# EAGLE design OSO-TIBO-A1-03 (WIP) (EAGLE 9.4.2)

## Sheet 1 of 2
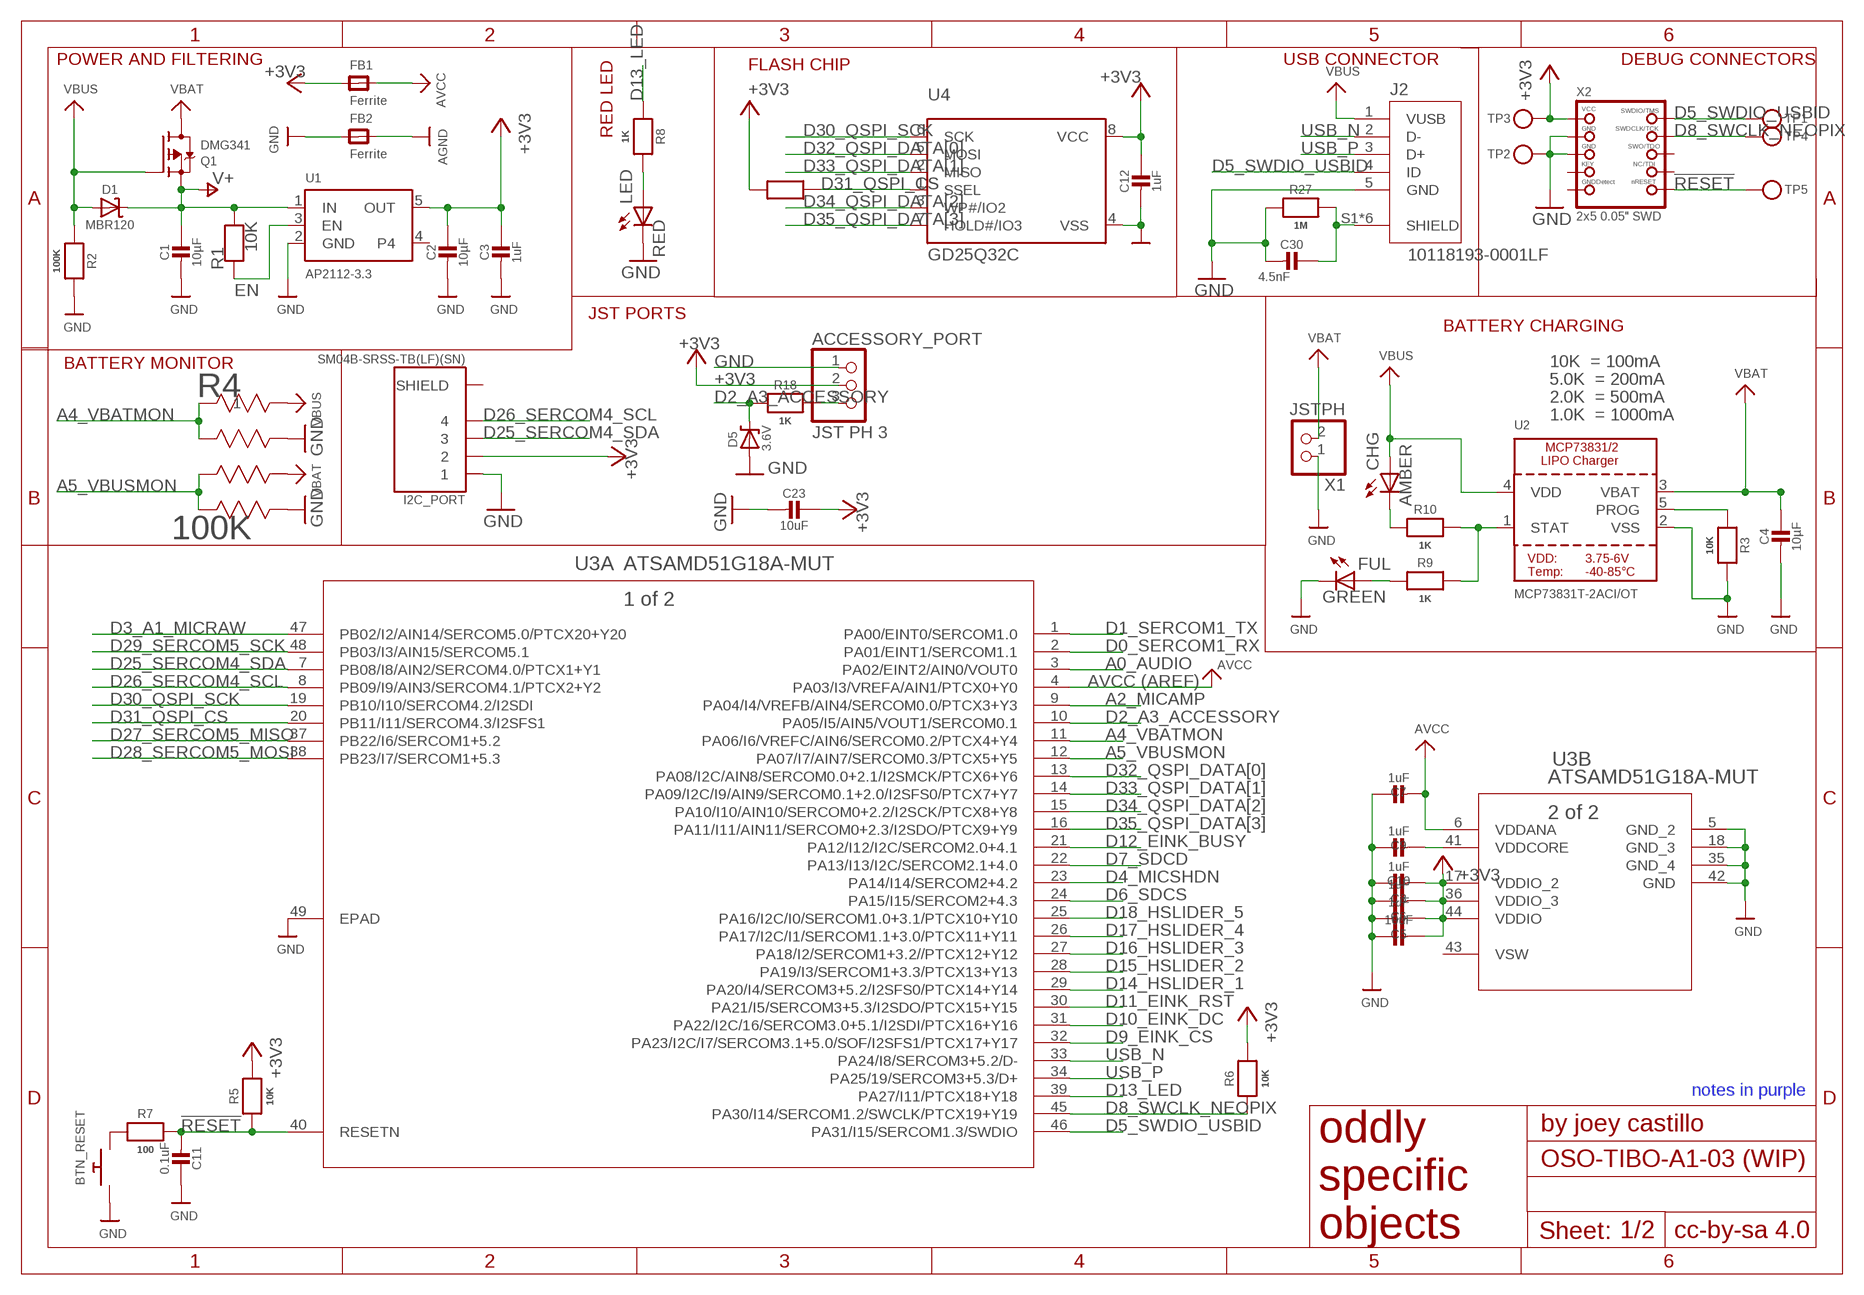
[diagram p0: schematic, sheet 1]

### Parts
ACCESSORY_PORT  JST PH 3  CON_JST_PH_3PIN  [JSTPH3]
BTN_RESET  SWITCH_PUSHBUTTONC&K_KSS  [BTN_CK_KSS]
C1  10µF  CAP_CERAMIC0805-NOOUTLINE  [0805-NO]
C2  10µF  CAP_CERAMIC0805-NOOUTLINE  [0805-NO]
C3  1uF  CAP_CERAMIC0805-NOOUTLINE  [0805-NO]
C4  10µF  CAP_CERAMIC0805-NOOUTLINE  [0805-NO]
C5  10uF  CAP_CERAMIC0805-NOOUTLINE  [0805-NO]
C6  1uF  CAP_CERAMIC0805-NOOUTLINE  [0805-NO]
C7  1uF  CAP_CERAMIC0805-NOOUTLINE  [0805-NO]
C8  1uF  CAP_CERAMIC0805_10MGAP  [0805_10MGAP]
C9  1uF  CAP_CERAMIC0805_10MGAP  [0805_10MGAP]
C10  1uF  CAP_CERAMIC0805_10MGAP  [0805_10MGAP]
C11  0.1uF  CAP_CERAMIC0805_10MGAP  [0805_10MGAP]
C12  1uF  CAP_CERAMIC0805_10MGAP  [0805_10MGAP]
C23  10uF  CAP_CERAMIC0805-NOOUTLINE  [0805-NO]
C30  4.5nF  CAP_CERAMIC0805-NOOUTLINE  [0805-NO]
CHG  AMBER  LEDCHIPLED_0805_REVERSEMOUNT  [CHIP-LED0805_REVERSEMOUNT]
D1  MBR120  DIODE-SCHOTTKYSOD-123  [SOD-123]
D5  3.6V  DIODE-ZENERSOD123  [SOD-123]
FB1  Ferrite  FERRITE0805  [0805]
FB2  Ferrite  FERRITE0805  [0805]
FUL  GREEN  LEDCHIPLED_0805_REVERSEMOUNT  [CHIP-LED0805_REVERSEMOUNT]
I2C_PORT  SM04B-SRSS-TB(LF)(SN)  [JST_SM04B-SRSS-TB(LF)(SN)]
J2  10118193-0001LF  [FCI_10118193-0001LF]
LED  RED  LEDCHIPLED_0805_REVERSEMOUNT  [CHIP-LED0805_REVERSEMOUNT]
Q1  DMG341  MOSFET-P  [SOT23-R]
R1  10K  RESISTOR0805_NOOUTLINE  [0805-NO]
R2  100K  RESISTOR0805_NOOUTLINE  [0805-NO]
R3  10K  RESISTOR0805_NOOUTLINE  [0805-NO]
R4  100K  EXB-V8V103JV  [EXBV8V]
R5  10K  RESISTOR0805_NOOUTLINE  [0805-NO]
R6  10K  RESISTOR0805_NOOUTLINE  [0805-NO]
R7  100  RESISTOR0805_10MGAP  [0805_10MGAP]
R8  1K  RESISTOR0805_NOOUTLINE  [0805-NO]
R9  1K  RESISTOR0805_NOOUTLINE  [0805-NO]
R10  1K  RESISTOR0805_NOOUTLINE  [0805-NO]
R11  10K  RESISTOR0805_NOOUTLINE  [0805-NO]
R18  1K  RESISTOR_0805MP  [_0805MP]
R27  1M  RESISTOR0805_NOOUTLINE  [0805-NO]
TP1  TESTPOINTROUND2MMNO  [TESTPOINT_ROUND_2MM_NO]
TP2  TESTPOINTROUND2MMNO  [TESTPOINT_ROUND_2MM_NO]
TP3  TESTPOINTROUND2MMNO  [TESTPOINT_ROUND_2MM_NO]
TP4  TESTPOINTROUND2MMNO  [TESTPOINT_ROUND_2MM_NO]
TP5  TESTPOINTROUND2MMNO  [TESTPOINT_ROUND_2MM_NO]
U1  AP2112-3.3  VREG_SOT23-5  [SOT23-5]
U2  MCP73831T-2ACI/OT  MCP73831/2  [SOT23-5]
U3  ATSAMD51G18A-MUT  [QFN48_7X7MC]
U4  GD25Q32C  MICROBUILDER_SPIFLASH_SOIC8  [MICROBUILDER_SOIC8_150MIL]
X1  JSTPH  CON_JST_PH_2PIN  [JSTPH2]
X2  2x5 0.05" SWD  JTAG-CORTEXBOXPOSTS  [2X05_1.27MM_BOX_POSTS]

### Nets
!RESET: C11.2 R5.1 R7.2 TP5.P$1 U3.40(A:RESETN) X2.10(NRESET)
+3V3 [power]: ACCESSORY_PORT.2 C2.1 C3.1 C5.2 C6.2 C8.2 C10.2 C12.1 C23.1 FB1.1 I2C_PORT.2 R5.2 R6.2 R11.2 TP3.P$1 U1.5(OUT) U3.17(B:VDDIO_2) U3.36(B:VDDIO_3) U3.44(B:VDDIO) U4.8(VCC) X2.1(VCC) ; also sheet 2
_ACCESSORY: ACCESSORY_PORT.3 R18.1
A0_AUDIO: U3.3(A:PA02/EINT2/AIN0/VOUT0) ; also sheet 2
A2_MICAMP: U3.9(A:PA04/I4/VREFB/AIN4/SERCOM0.0/PTCX3+Y3) ; also sheet 2
A4_VBATMON: R4.1 R4.2 U3.11(A:PA06/I6/VREFC/AIN6/SERCOM0.2/PTCX4+Y4)
A5_VBUSMON: R4.3 R4.4 U3.12(A:PA07/I7/AIN7/SERCOM0.3/PTCX5+Y5)
AGND [gnd]: FB2.2 ; also sheet 2
AVCC: C7.2 FB1.2 U3.4(A:PA03/I3/VREFA/AIN1/PTCX0+Y0) U3.6(B:VDDANA) ; also sheet 2
D0_SERCOM1_RX: U3.2(A:PA01/EINT1/SERCOM1.1) ; also sheet 2
D1_SERCOM1_TX: U3.1(A:PA00/EINT0/SERCOM1.0) ; also sheet 2
D2_A3_ACCESSORY: D5.C R18.2 U3.10(A:PA05/I5/AIN5/VOUT1/SERCOM0.1)
D3_A1_MICRAW: U3.47(A:PB02/I2/AIN14/SERCOM5.0/PTCX20+Y20) ; also sheet 2
D4_MICSHDN: U3.23(A:PA14/I14/SERCOM2+4.2) ; also sheet 2
D5_SWDIO_USBID: J2.4(ID) TP1.P$1 U3.46(A:PA31/I15/SERCOM1.3/SWDIO) X2.2(SWDIO)
D6_SDCS: U3.24(A:PA15/I15/SERCOM2+4.3) ; also sheet 2
D7_SDCD: U3.22(A:PA13/I13/I2C/SERCOM2.1+4.0) ; also sheet 2
D8_SWCLK_NEOPIX: R6.1 TP4.P$1 U3.45(A:PA30/I14/SERCOM1.2/SWCLK/PTCX19+Y19) X2.4(SWDCLK) ; also sheet 2
D9_EINK_CS: U3.32(A:PA23/I2C/I7/SERCOM3.1+5.0/SOF/I2SFS1/PTCX17+Y17) ; also sheet 2
D10_EINK_DC: U3.31(A:PA22/I2C/16/SERCOM3.0+5.1/I2SDI/PTCX16+Y16) ; also sheet 2
D11_EINK_RST: U3.30(A:PA21/I5/SERCOM3+5.3/I2SDO/PTCX15+Y15) ; also sheet 2
D12_EINK_BUSY: U3.21(A:PA12/I12/I2C/SERCOM2.0+4.1) ; also sheet 2
D13_LED: R8.1 U3.39(A:PA27/I11/PTCX18+Y18)
D14_HSLIDER_1: U3.29(A:PA20/I4/SERCOM3+5.2/I2SFS0/PTCX14+Y14) ; also sheet 2
D15_HSLIDER_2: U3.28(A:PA19/I3/SERCOM1+3.3/PTCX13+Y13) ; also sheet 2
D16_HSLIDER_3: U3.27(A:PA18/I2/SERCOM1+3.2//PTCX12+Y12) ; also sheet 2
D17_HSLIDER_4: U3.26(A:PA17/I2C/I1/SERCOM1.1+3.0/PTCX11+Y11) ; also sheet 2
D18_HSLIDER_5: U3.25(A:PA16/I2C/I0/SERCOM1.0+3.1/PTCX10+Y10) ; also sheet 2
D25_SERCOM4_SDA: I2C_PORT.3 U3.7(A:PB08/I8/AIN2/SERCOM4.0/PTCX1+Y1)
D26_SERCOM4_SCL: I2C_PORT.4 U3.8(A:PB09/I9/AIN3/SERCOM4.1/PTCX2+Y2)
D27_SERCOM5_MISO: U3.37(A:PB22/I6/SERCOM1+5.2) ; also sheet 2
D28_SERCOM5_MOSI: U3.38(A:PB23/I7/SERCOM1+5.3) ; also sheet 2
D29_SERCOM5_SCK: U3.48(A:PB03/I3/AIN15/SERCOM5.1) ; also sheet 2
D30_QSPI_SCK: U3.19(A:PB10/I10/SERCOM4.2/I2SDI) U4.6(SCK)
D31_QSPI_CS: R11.1 U3.20(A:PB11/I11/SERCOM4.3/I2SFS1) U4.1(SSEL)
D32_QSPI_DATA[0]: U3.13(A:PA08/I2C/AIN8/SERCOM0.0+2.1/I2SMCK/PTCX6+Y6) U4.5(MOSI)
D33_QSPI_DATA[1]: U3.14(A:PA09/I2C/I9/AIN9/SERCOM0.1+2.0/I2SFS0/PTCX7+Y7) U4.2(MISO)
D34_QSPI_DATA[2]: U3.15(A:PA10/I10/AIN10/SERCOM0+2.2/I2SCK/PTCX8+Y8) U4.3(WP#/IO2)
D35_QSPI_DATA[3]: U3.16(A:PA11/I11/AIN11/SERCOM0+2.3/I2SDO/PTCX9+Y9) U4.7(HOLD#/IO3)
EN: R1.1 U1.3(EN) ; also sheet 2
GND [gnd]: ACCESSORY_PORT.1 BTN_RESET.P$1 C1.2 C2.2 C3.2 C4.2 C5.1 C6.1 C7.1 C8.1 C9.1 C10.1 C11.1 C12.2 C23.2 C30.2 D5.A FB2.1 FUL.C I2C_PORT.1 J2.5(GND) LED.C R2.2 R3.2 R4.5 R4.7 R27.2 TP2.P$1 U1.2(GND) U2.2(VSS) U3.5(B:GND_2) U3.18(B:GND_3) U3.35(B:GND_4) U3.42(B:GND) U3.49(A:EPAD) U4.4(VSS) X1.1 X2.3(GND) X2.5(GND) ; also sheet 2
N$1: BTN_RESET.P$2 R7.1
N$4: CHG.C R10.1
N$7: LED.A R8.2
N$9: FUL.A R9.1
PROG: R3.1 U2.5(PROG)
SHIELD [gnd]: C30.1 J2.S1(SHIELD) J2.S2(SHIELD) J2.S3(SHIELD) J2.S4(SHIELD) J2.S5(SHIELD) J2.S6(SHIELD) R27.1
STAT: R9.2 R10.2 U2.1(STAT)
USB_N: J2.2(D-) U3.33(A:PA24/I8/SERCOM3+5.2/D-)
USB_P: J2.3(D+) U3.34(A:PA25/19/SERCOM3+5.3/D+)
V+ [power]: C1.1 D1.C Q1.2(S) R1.2 U1.1(IN)
VBAT [power]: C4.1 Q1.3(D) R4.6 U2.3(VBAT) X1.2
VBUS [power]: CHG.A D1.A J2.1(VUSB) Q1.1(G) R2.1 R4.8 U2.4(VDD)
VDDCORE: C9.2 U3.41(B:VDDCORE)
Unconnected: I2C_PORT.S1(SHIELD) I2C_PORT.S2(SHIELD) U1.4 X2.6(SWO) X2.7(KEY) X2.8(TDI) X2.9(GNDDETECT)

### Notes on the sheet
- RED LED
- POWER AND FILTERING | USB CONNECTOR | DEBUG CONNECTORS
- FLASH CHIP
- JST PORTS
- BATTERY CHARGING
- BATTERY MONITOR | 10K  = 100mA
- 5.0K  = 200mA
- 2.0K  = 500mA
- 1.0K  = 1000mA
- (AREF)
- notes in purple

## Sheet 2 of 2
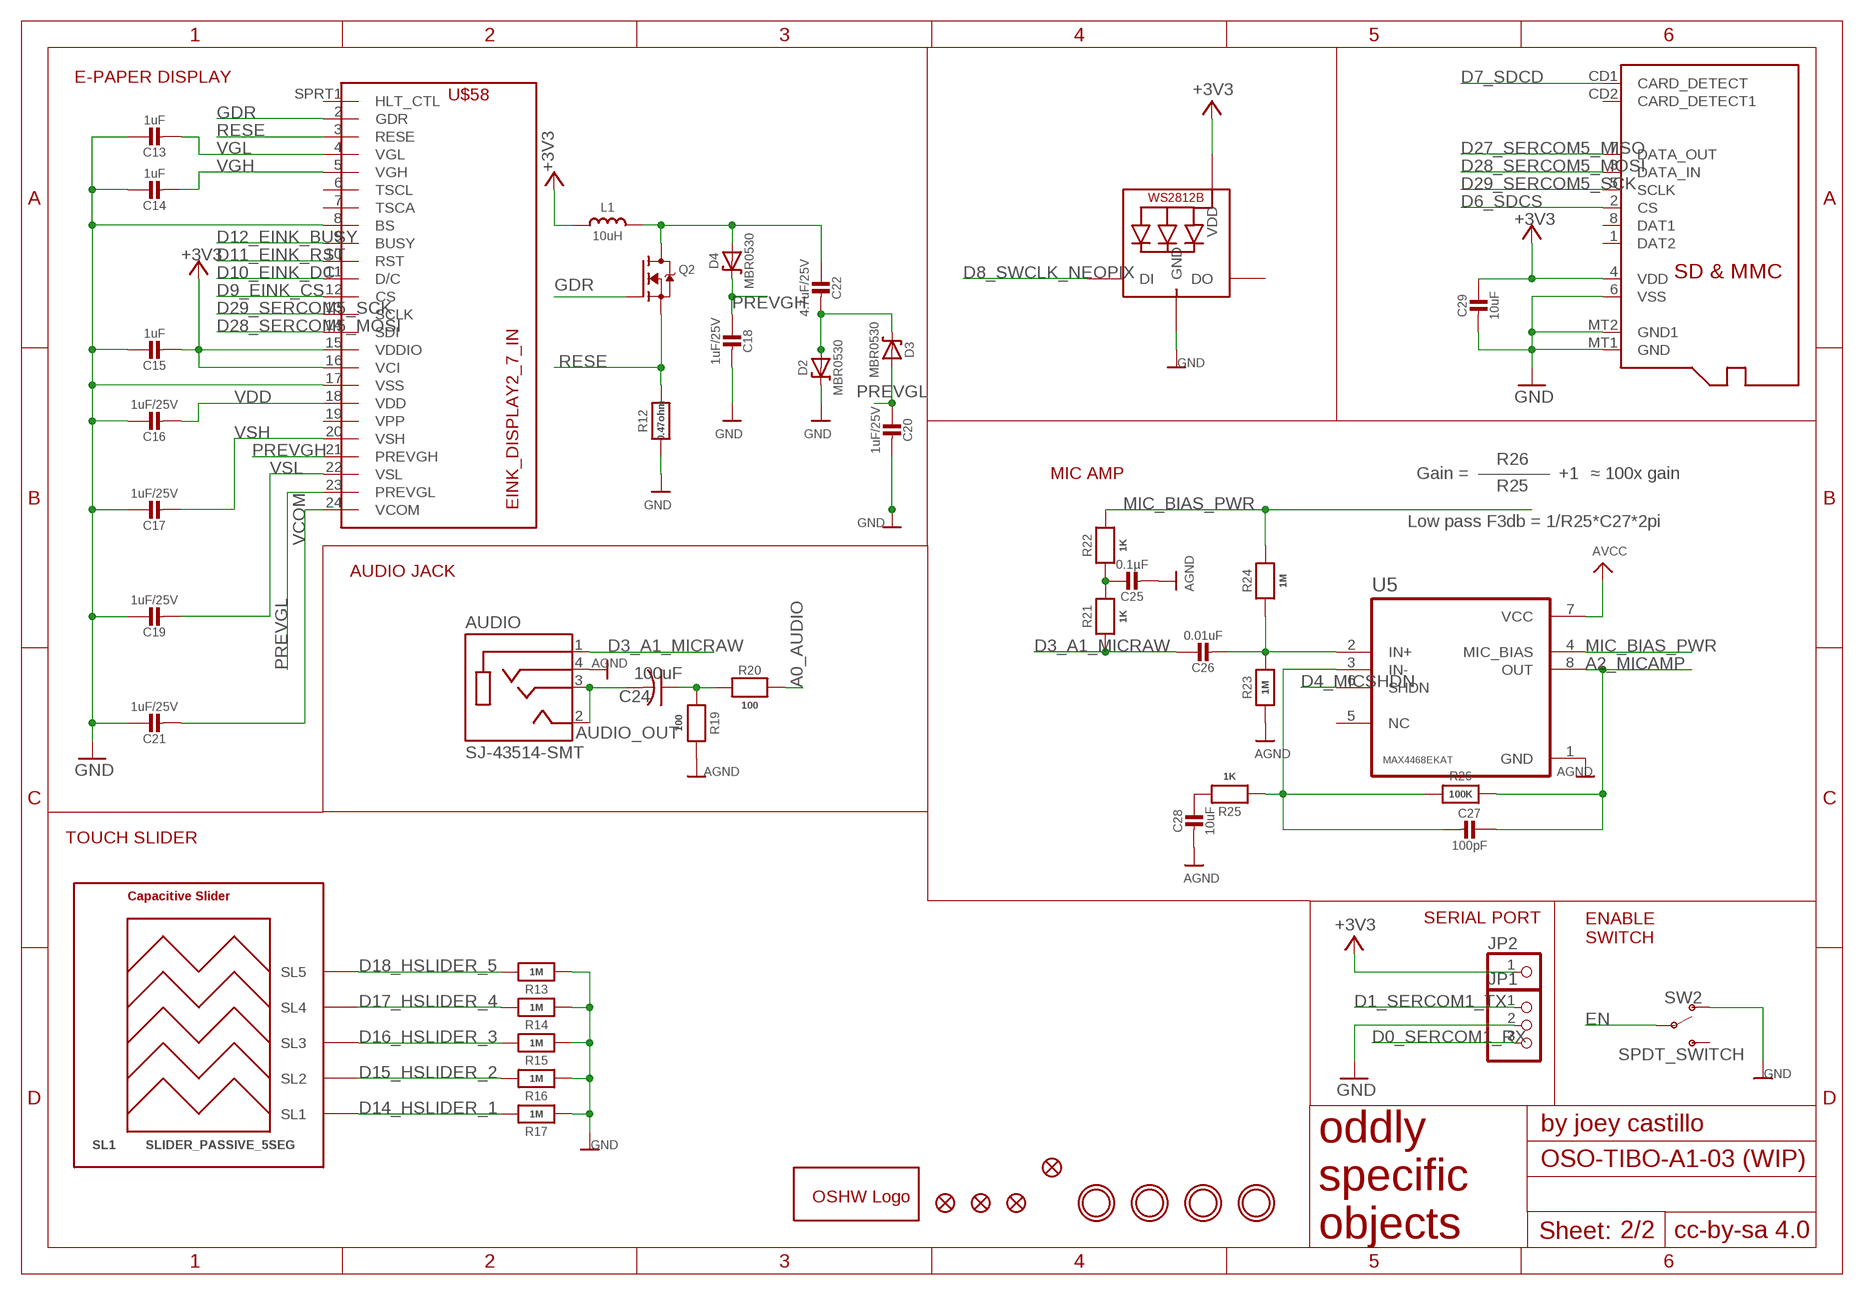
[diagram p1: schematic, sheet 2]

### Parts
AUDIO  SJ-43514-SMT  [CUI_SJ-43514-SMT]
C13  1uF  CAP_CERAMIC0805_10MGAP  [0805_10MGAP]
C14  1uF  CAP_CERAMIC0805_10MGAP  [0805_10MGAP]
C15  1uF  CAP_CERAMIC0805_10MGAP  [0805_10MGAP]
C16  1uF/25V  CAP_CERAMIC0805_10MGAP  [0805_10MGAP]
C17  1uF/25V  CAP_CERAMIC0805_10MGAP  [0805_10MGAP]
C18  1uF/25V  CAP_CERAMIC0805_10MGAP  [0805_10MGAP]
C19  1uF/25V  CAP_CERAMIC0805_10MGAP  [0805_10MGAP]
C20  1uF/25V  CAP_CERAMIC0805_10MGAP  [0805_10MGAP]
C21  1uF/25V  CAP_CERAMIC0805_10MGAP  [0805_10MGAP]
C22  4.7uF/25V  CAP_CERAMIC0805-NOOUTLINE  [0805-NO]
C24  100uF  C-USC1210  [C1210]
C25  0.1µF  CAP_CERAMIC0805-NOOUTLINE  [0805-NO]
C26  0.01uF  CAP_CERAMIC0805-NOOUTLINE  [0805-NO]
C27  100pF  CAP_CERAMIC0805-NOOUTLINE  [0805-NO]
C28  10uF  CAP_CERAMIC0805-NOOUTLINE  [0805-NO]
C29  10uF  CAP_CERAMIC0805_10MGAP  [0805_10MGAP]
D2  MBR0530  DIODE-SCHOTTKYSOD-123  [SOD-123]
D3  MBR0530  DIODE-SCHOTTKYSOD-123  [SOD-123]
D4  MBR0530  DIODE-SCHOTTKYSOD-123  [SOD-123]
D8_NEOPIXEL  WS2812B_4020  [WS2812B_4020]
FID1  FIDUCIAL_1MM  [FIDUCIAL_1MM]
FID2  FIDUCIAL_1MM  [FIDUCIAL_1MM]
FID3  FIDUCIAL_1MM  [FIDUCIAL_1MM]
FID4  FIDUCIAL_1MM  [FIDUCIAL_1MM]
GOLD_ORB_SM1  OSHWLOGOLOGO5MM  [OSHW_5MM]
JP1  PINHD-1X3  [1X03]
JP2  PINHD-1X1  [1X01]
L1  10uH  INDUCTORNR401  [INDUCTOR_4X4MM_NR401]
MICROSD  MICROSD  [MICROSD]
Q2  IRLML0100  IRLML2060TRPBF  [SOT23-3]
R12  0.47ohm  RESISTOR0805_10MGAP  [0805_10MGAP]
R13  1M  RESISTOR0805_NOOUTLINE  [0805-NO]
R14  1M  RESISTOR0805_NOOUTLINE  [0805-NO]
R15  1M  RESISTOR0805_NOOUTLINE  [0805-NO]
R16  1M  RESISTOR0805_NOOUTLINE  [0805-NO]
R17  1M  RESISTOR0805_NOOUTLINE  [0805-NO]
R19  100  RESISTOR0805_NOOUTLINE  [0805-NO]
R20  100  RESISTOR0805_NOOUTLINE  [0805-NO]
R21  1K  RESISTOR0805_NOOUTLINE  [0805-NO]
R22  1K  RESISTOR0805_NOOUTLINE  [0805-NO]
R23  1M  RESISTOR0805_NOOUTLINE  [0805-NO]
R24  1M  RESISTOR0805_NOOUTLINE  [0805-NO]
R25  1K  RESISTOR0805_NOOUTLINE  [0805-NO]
R26  100K  RESISTOR0805_NOOUTLINE  [0805-NO]
SL1  SLIDER_PASSIVE_5SEG  [SLIDER_PASSIVE_5SEG_12MM]
SW2  SPDT_SWITCH  [A10767]
U5  MAX4468EKAT  [SOT65P280X145-8N]
U$1  MOUNTINGHOLE2.5  [MOUNTINGHOLE_2.5_PLATED]
U$4  MOUNTINGHOLE2.5  [MOUNTINGHOLE_2.5_PLATED]
U$5  MOUNTINGHOLE2.5  [MOUNTINGHOLE_2.5_PLATED]
U$7  MOUNTINGHOLE2.5  [MOUNTINGHOLE_2.5_PLATED]
U$58  EINK_DISPLAY2_7_IN  [EINK_DISPLAY_2_7_IN]

### Nets
+3V3 [power]: C15.2 C29.1 D8_NEOPIXEL.2(VDD) JP2.1 L1.P$2 MICROSD.4(VDD) U$58.15(VDDIO) U$58.16(VCI) ; also sheet 1
A0_AUDIO: R20.1 ; also sheet 1
A2_MICAMP: C27.1 R26.2 U5.8(OUT) ; also sheet 1
AGND [gnd]: AUDIO.4(RING2) C25.2 C28.2 R19.1 R23.1 U5.1(GND) ; also sheet 1
AUDIO_OUT: AUDIO.2(TIP) AUDIO.3(RING1) C24.2
AVCC: U5.7(VCC) ; also sheet 1
D0_SERCOM1_RX: JP1.3 ; also sheet 1
D1_SERCOM1_TX: JP1.1 ; also sheet 1
D3_A1_MICRAW: AUDIO.1(SLEEVE) C26.1 R21.1 ; also sheet 1
D4_MICSHDN: U5.6(SHDN) ; also sheet 1
D6_SDCS: MICROSD.2(CS) ; also sheet 1
D7_SDCD: MICROSD.CD1(CARD_DETECT) ; also sheet 1
D8_SWCLK_NEOPIX: D8_NEOPIXEL.1(DI) ; also sheet 1
D9_EINK_CS: U$58.12(CS) ; also sheet 1
D10_EINK_DC: U$58.11(D/C) ; also sheet 1
D11_EINK_RST: U$58.10(RST) ; also sheet 1
D12_EINK_BUSY: U$58.9(BUSY) ; also sheet 1
D14_HSLIDER_1: R17.2 SL1.SL1 ; also sheet 1
D15_HSLIDER_2: R16.2 SL1.SL2 ; also sheet 1
D16_HSLIDER_3: R15.2 SL1.SL3 ; also sheet 1
D17_HSLIDER_4: R14.2 SL1.SL4 ; also sheet 1
D18_HSLIDER_5: R13.2 SL1.SL5 ; also sheet 1
D27_SERCOM5_MISO: MICROSD.7(DATA_OUT) ; also sheet 1
D28_SERCOM5_MOSI: MICROSD.3(DATA_IN) U$58.14(SDI) ; also sheet 1
D29_SERCOM5_SCK: MICROSD.5(SCLK) U$58.13(SCLK) ; also sheet 1
EN: SW2.P$2(P) ; also sheet 1
GDR: Q2.1(G) U$58.2(GDR)
GND [gnd]: C13.1 C14.1 C15.1 C16.1 C17.1 C18.2 C19.1 C20.2 C21.1 C29.2 D2.C D8_NEOPIXEL.4(GND) JP1.2 MICROSD.6(VSS) MICROSD.MT1(GND) MICROSD.MT2(GND1) R12.2 R13.1 R14.1 R15.1 R16.1 R17.1 SW2.P$1(O) U$58.8(BS) U$58.17(VSS) ; also sheet 1
MIC_BIAS_PWR: R22.2 R24.2 U5.4(MIC_BIAS)
N$2: C22.2 D2.A D3.C
N$3: C22.1 D4.A L1.P$1 Q2.3(D)
N$6: C24.1 R19.2 R20.2
N$65: C25.1 R21.2 R22.1
N$67: C26.2 R23.2 R24.1 U5.2(IN+)
N$68: C27.2 R25.1 R26.1 U5.3(IN-)
N$69: C28.1 R25.2
PREVGH: C18.1 D4.C U$58.21(PREVGH)
PREVGL: C20.1 D3.A U$58.23(PREVGL)
RESE: Q2.2(S) R12.1 U$58.3(RESE)
VCOM: C21.2 U$58.24(VCOM)
VDD: C16.2 U$58.18(VDD)
VGH: C14.2 U$58.5(VGH)
VGL: C13.2 U$58.4(VGL)
VSH: C17.2 U$58.20(VSH)
VSL: C19.2 U$58.22(VSL)
Unconnected: D8_NEOPIXEL.3(DO) MICROSD.1(DAT2) MICROSD.8(DAT1) MICROSD.CD2(CARD_DETECT1) SW2.P$3(S) U5.5(NC) U$58.6(TSCL) U$58.7(TSCA) U$58.19(VPP) U$58.SPRT1(HLT_CTL)

### Notes on the sheet
- E-PAPER DISPLAY
- R26
- MIC AMP | Gain = | +1 | ≈ 100x gain
- R25
- Low pass F3db = 1/R25*C27*2pi
- AUDIO JACK
- TOUCH SLIDER
- SERIAL PORT
- ENABLE
  SWITCH

## Power pins joined to a net without a drawn wire
VSW: U3.43(B:VSW)

## Library data of the parts
ACCESSORY_PORT = microbuilder:CON_JST_PH_3PIN
AUDIO = SJ-43514-SMT:SJ-43514-SMT: 4 conductor 3.5 mm Surface Mount Audio Jack; CUI_PURCHASE_URL: https://www.cui.com/product/interconnect/connectors/audio-connectors/jacks/sj-4351x-smt-series?utm_source=snapeda.com&utm_medium=referral&utm_campaign=snapedaBOM; DESCRIPTION: 3.5 mm, 4 Conductors, Right Angle, Surface Mount _SMT_, Audio Jack Connector; DIGI-KEY_PART_NUMBER: CP-43514SJCT-ND; DIGI-KEY_PURCHASE_URL: https://www.digikey.com/product-detail/en/cui-inc/SJ-43514-SMT-TR/CP-43514SJCT-ND/669734?utm_source=snapeda&utm_medium=aggregator&utm_campaign=symbol; MF: CUI Inc.; MP: SJ-43514-SMT-TR; PACKAGE: None
BTN_RESET = adafruit:SWITCH_PUSHBUTTON: Buttons SOFTTOUCHSMD_SJ - Soft touch temporary push button (Super Junk Akihabara) Compatible with SKPMANE010 [Mouser: 688-SKPMAN] C&K_KSS = Digikey: KSS221GLFS
C1-C23 C25-C30 = microbuilder:CAP_CERAMIC: Ceramic Capacitors For new designs, use the packages preceded by an '_' character since they are more reliable: The following footprints should be used on most boards: _0402 - Standard footprint for regular board layouts _0603 - Standard footprint for regular board layouts _0805 - Standard footprint for regular board layouts _1206 - Standard footprint for regular board layouts For extremely tight-pitch boards where space is at a premium, the following 'micro-pitch' footprints can be used (smaller pads, no silkscreen outline, etc.): _0402MP - Micro-pitch footprint for very dense/compact boards _0603MP - Micro-pitch footprint for very dense/compact boards _0805MP - Micro-pitch footprint for very dense/compact boards _1206MP - Micro-pitch footprint for very dense/compact boards
C24 = resistor:C-US: CAPACITOR, American symbol
CHG FUL LED = adafruit:LED: LED OSRAM: - CHIPLED LG R971, LG N971, LY N971, LG Q971, LY Q971, LO R971, LY R971 LH N974, LH R974 LS Q976, LO Q976, LY Q976 LO Q996 - Hyper CHIPLED LW Q18S LB Q993, LB Q99A, LB R99A - SideLED LS A670, LO A670, LY A670, LG A670, LP A670 LB A673, LV A673, LT A673, LW A673 LH A674 LY A675 LS A676, LA A676, LO A676, LY A676, LW A676 LS A679, LY A679, LG A679 - Hyper Micro SIDELED® LS Y876, LA Y876, LO Y876, LY Y876 LT Y87S - SmartLED LW L88C, LW L88S LB L89C, LB L89S, LG L890 LS L89K, LO L89K, LY L89K LS L896, LA L896, LO L896, LY L896 - TOPLED LS T670, LO T670, LY T670, LG T670, LP T670 LSG T670, LSP T670, LSY T670, LOP T670, LYG T670 LG T671, LOG T671, LSG T671 LB T673, LV T673, LT T673, LW T673 LH T674 LS T676, LA T676, LO T676, LY T676, LB T676, LH T676, LSB T676, LW T676 LB T67C, LV T67C, LT T67C, LS T67K, LO T67K, LY T67K, LW E67C LS E67B, LA E67B, LO E67B, LY E67B, LB E67C, LV E67C, LT E67C LW T67C LS T679, LY T679, LG T679 LS T770, LO T770, LY T770, LG T770, LP T770 LB T773, LV T773, LT T773, LW T773 LH T774 LS E675, LA E675, LY E675, LS T675 LS T776, LA T776, LO T776, LY T776, LB T776 LHGB T686 LT T68C, LB T68C - Hyper Mini TOPLED® LB M676 - Mini TOPLED Santana® LG M470 LS M47K, LO M47K, LY M47K Source: http://www.osram.convergy.de/
D1-D4 = microbuilder:DIODE-SCHOTTKY
D5 = microbuilder:DIODE-ZENER: Zener Diode SMA: 30V 1W Zener Diode, 1.2Vf - Digikey: SMAZ30-FDICT-ND
D8_NEOPIXEL = microbuilder:WS2812B
FB1 FB2 = microbuilder:FERRITE: Ferrite Bead 0603 MMZ1608B121C - 120 Ohm @ 100MHz, 600mA, 0.15 Ohm DC Resistance - Digikey: 445-2164-1-ND BK1608HW121-T - 120 Ohm, 600mA Ferrite Chip - Digikey: 587-1876-2-ND 0805 HZ0805B272R-10 - 2.7K Ohm @ 100MHz, 200mA, 0.8 Ohm DC Resistance - Digikey: 240-2504-1-ND (see also Murata BLM21BD272SN1L) MMZ2012Y152B - 1.5K Ohm @ 100MHz, 500mA, 0.4 Ohm DC Resistance - Digikey: 445-1560-1-ND - Mainly for high frequency (80-400MHz) MMZ2012R102A - 1K Ohm @ 100MHz, 500mA, 0.3 Ohm DC Resistance - Digikey: 445-1555-2-ND - More general purpose (10-200MHz)
FID1-FID4 = microbuilder:FIDUCIAL: Fiducial Alignment Points Various fiducial points for machine vision alignment.; BOM: EXCLUDE
GOLD_ORB_SM1 = oshw:OSHWLOGO: The OSHW logo for PCB layout
I2C_PORT = SM04B-SRSS-TB_LF__SN_:SM04B-SRSS-TB(LF)(SN): SH Series 1.0 mm Pitch 2 Position Single Row Side Entry Shrouded Header; DESCRIPTION: SH Series 1.0 mm Pitch 2 Position Single Row Side Entry Shrouded Header; DIGI-KEY_PART_NUMBER: 455-1804-1-ND; DIGI-KEY_PURCHASE_URL: https://www.digikey.com/product-detail/en/jst-sales-america-inc/SM04B-SRSS-TB_LF__SN_/455-1804-1-ND/926875?utm_source=snapeda&utm_medium=aggregator&utm_campaign=symbol; MF: JST Sales; MP: SM04B-SRSS-TB_LF__SN_; PACKAGE: None
J2 = 10118193-0001LF:10118193-0001LF: Micro USB B Type Receptacle; DESCRIPTION: Single Port 5 Contact Shielded SMT MICRO USB B-Type Receptacle; DIGI-KEY_PART_NUMBER: 609-4616-1-ND; DIGI-KEY_PURCHASE_URL: https://www.digikey.com/product-detail/en/amphenol-icc-fci/10118193-0001LF/609-4616-1-ND/2785380?utm_source=snapeda&utm_medium=aggregator&utm_campaign=symbol; MF: Amphenol ICC; MP: 10118193-0001LF; PACKAGE: None
JP1 = adafruit:PINHD-1X3: PIN HEADER
JP2 = adafruit:PINHD-1X1: Pin header 1x1 for 0.1" spacing With round pins
L1 = microbuilder:INDUCTOR: Inductors 0603: 10nH Ceramic Inductor - microwire antenna/RF (Digikey: 712-1434-2-ND) 0805: 560nH Ceramic Inductor - RF (Digikey: 553-1047-1-ND) 270nH Ceramic Inductor - Q = 40@250MHz, +-5%, 1 Ohm DC Resistance (Digikey: 535-10506-2-ND) 1007 (2518 Metric) SMT: 10µH 10% 250mOhm 820mA 1007 Inductor (Digikey: 587-2189-1-ND) 22µH 10% 500mOhm 580mA 1007 Inductor (Digikey: 587-2190-1-ND) 47µH 10% 950mOhm 420mA 1007 Inductor (Digikey: 587-2191-1-ND) 47µH 5% 100mOhm 1A 1008 Inductor (Digikey: 732-1816-1-ND) 5.0x5.0mm (Taiyo Yuden NR5040 Series) 6.8µH 20% 2.3A 64mOhm Inductor (Digikey: 587-2374-2-ND) 5.0x5.0mm (TDK VLC5045 Series) 4.7µH 20% 3.3A 34mOhm Inductor (Digikey: 445-6526-1-ND) 6.8µH 20% 2.7A 46mOhm Inductor (Digikey: 445-6527-1-ND) 6.0x6.0mm (TDK VLC6045 Series) 4.7µH 20% 3.8A 27mOhm Inductor (Digikey: 445-6538-2-ND) 6.8µH 20% 3A 41mOhm Inductor (Digikey: 445-6540-1-ND) 6.2µH 30% 2.2A 45mOhm Inductor (Digikey: SRR5028-6R2YCT-ND) - Not TDK VLC6045 but footprint should match 6.0x6.0mm (TDK SLF6045 Series) 6.8uH 30% 2A 33mOhm Inductor (Digikey: 445-4572-1-ND, Mouser: 810-SLF645T6R8N2R0PF) 6.0x6.0mm (Sumida CDRH5D28 Series) 6.2uH 30% 1.8A 45mOhm Inductor (Digikey: 308-1542-1-ND) Taiyo Yuden NR3015T2R2M - 2.2uH 20% 1.5A (Digikey: 587-1648-2-ND, Mouser: 963-NR3015T2R2M) - Used with TI TPS62172 CoilCraft RFID Transponder Coil - MA5532-AE (For use with AS3935 Lightning Sensor) Taiyo Yuden NRH2412T2R2MNGH - 2.2uH 20% 1AA (Digikey: 587-3443-1-ND) - Used with TI LM3671 Vishay IHLP 1.0uH Molded Inductor - 24mOhm DCR, 5A, +/-20%, -55°C-125°C (Digikey: 541-1319-1-ND)
MICROSD = adafruit:MICROSD: Micro-SD / Transflash card holder with SPI pinout For the 3M # 2908-05WB-MG and/or 4UCON #19656 push-push type
Q1 = microbuilder:MOSFET-P: P-Channel Mosfet LEGEND VDS: Voltage Drain-Source ID: Drain Current RDS(ON): Drain-Source On-State Resistance VGS(TH): Gate-Source Threshold Voltage CISS: Drain-Source Input Capacitance SOT-23 Name VDS ID RDS(ON) VGS(TH) CISS Order Number IRLML5103 30V 760mA 600 mOhm -- 75pF @ 25V Digikey: IRLML5103PBFCT-ND IRLML6401 12V 4.3A 50 mOhm 950mV @ 250µA 830pF @ 10V Digikey: IRLML6401PBFTR-ND NTR0202PL 20V 400mA 800 mOhm 2.3V @ 250uA 70pF @ 5V Digikey: NTR0202PLT1GOSTR-ND NTR4101PT1G 20V 1.8A 85 mOhm 1.2V @ 250uA 675pF @ 10V Digikey: NTR4101PT1GOSCT-ND DMP2004K 20V 600mA 900 mOhm 1V @ 250uA 175pF @ 16V Digikey: DMP2004KDICT-ND PMV65XP 20V 3.9A 76 mOhm 950mV @ 1mA 725pF @ 20V Digikey: 568-2358-2-ND TO-252 Name VDS ID RDS(ON) VGS(TH) CISS Order Number AOD417 30V 25A 34 mOhm 3V @ 250µA 920pF @ 15V Digikey: 785-1106-2-ND PowerPak Name VDS ID RDS(ON) VGS(TH) CISS Order Number AON7401 30V 12A 14 mOhm 3V @ 250µA 2600pF @ 15V Digikey: 785-1302-1-ND
Q2 = Parts:IRLML2060TRPBF
R1-R3 R5-R27 = microbuilder:RESISTOR: Resistors For new designs, use the packages preceded by an '_' character since they are more reliable: The following footprints should be used on most boards: _0402 - Standard footprint for regular board layouts _0603 - Standard footprint for regular board layouts _0805 - Standard footprint for regular board layouts _1206 - Standard footprint for regular board layouts For extremely tight-pitch boards where space is at a premium, the following 'micro-pitch' footprints can be used (smaller pads, no silkscreen outline, etc.): _0402MP - Micro-pitch footprint for very dense/compact boards _0603MP - Micro-pitch footprint for very dense/compact boards _0805MP - Micro-pitch footprint for very dense/compact boards _1206MP - Micro-pitch footprint for very dense/compact boards
R4 = resistor array:EXB-V8V103JV; MANUFACTURER_PART_NUMBER: EXBV8V103JV; VENDOR: Panasonic
SL1 = PatternAgents-TouchWidgets:SLIDER_PASSIVE_5SEG: Slider, Passive Touch/Capacitive Sensing Type, Five (5) Segment Source : http://www.PatternAgents.com Github : https://github.com/PatternAgents License : http://creativecommons.org/licenses/by-sa/3.1/ (Creative Commons 3.1) THIS SOFTWARE IS PROVIDED BY THE CONTRIBUTORS "AS IS" AND WITHOUT ANY EXPRESS OR IMPLIED WARRANTIES, INCLUDING, BUT NOT LIMITED TO, THE IMPLIED WARRANTIES OF MERCHANTABILITY AND FITNESS FOR A PARTICULAR PURPOSE ARE DISCLAIMED. IN NO EVENT SHALL THE COPYRIGHT OWNER OR CONTRIBUTORS BE LIABLE FOR ANY DIRECT, INDIRECT, INCIDENTAL, SPECIAL, EXEMPLARY, OR CONSEQUENTIAL DAMAGES (INCLUDING, BUT NOT LIMITED TO, PROCUREMENT OF SUBSTITUTE GOODS OR SERVICES; LOSS OF USE, DATA, OR PROFITS; OR BUSINESS INTERRUPTION) HOWEVER CAUSED AND ON ANY THEORY OF LIABILITY, WHETHER IN CONTRACT, STRICT LIABILITY, OR TORT (INCLUDING NEGLIGENCE OR OTHERWISE) ARISING IN ANY WAY OUT OF THE USE OF THIS SOFTWARE, EVEN IF ADVISED OF THE POSSIBILITY OF SUCH DAMAGE.
SW2 = My Stuff:SPDT_SWITCH
TP1-TP5 = microbuilder:TESTPOINT: Test Point Various test points for characterisation and PCB testing TESTPOINT_SMT - Compact Surface Mount Test Point [Digikey: 5016KTR-ND]
U1 = microbuilder:VREG_SOT23-5: SOT23-5 Fixed Voltage Regulators Part Current Out V Out V In V Dropout θJA (°C/W) TJ (°C) Digikey Part No. ADP121 150mA 3.3V 3.4-5.5V 0.09V @ 150mA -- -- ADP121-AUJZ33R7CT-ND ADP121 150mA 3.0V 3.1-5.5V 0.09V @ 150mA -- -- ADP121-AUJZ30R7CT-ND ADP122 300mA 3.3V 3.4-5.5V 0.085V @ 300mA -- -- ADP122AUJZ-3.3-R7CT-ND ADP1712 300mA 3.3V 3.5-5.5V 0.17V @ 300mA -- -- ADP1712AUJZ-3.3-R7TR-ND AP7311 (Low Cost) 150mA 3.3V 3.5-6V 0.15V @ 150mA -- -- AP7311-33WG-7DICT-ND LD39015M18R 150mA 1.8V 1.9V-5.5V 0.08V @ 100mA -- -- 497-6977-1-ND LP2985A-33DBVR 150mA 3.3V 3.3-16V 0.28V @ 150mA 206 150 296-18479-1-ND MCP1824T-3302E/OT 300mA 3.3V 3.5V-6V 0.2V @ 300mA -- -- MCP1824T-3302E/OTCT-ND MIC5205-2.5YM5 TR 150mA 2.5V 2.7-16V 0.165V @ 150mA -- -- 576-1257-2-ND MIC5205-3.0YM5 TR 150mA 3.0V 3.2V-16V 0.165V @ 150mA -- -- 576-1258-2-ND MIC5205-3.3YM5 TR 150mA 3.3V 3.5V-16V 0.165V @ 150mA -- -- 576-1259-2-ND TPS780330220 150mA 3.3V+2.2V 3.6-5.5V 250mV Max -- -- 296-23332-1-ND TDA3663/N1,135 100mA 3.3V 3.5-45V 0.18V @ 50mA -- -- 568-5343-1-ND Max operating temp can be calculated using θJA, TJ (max junction temperature), and power in watts. Set the "Maximum Ambient Temperature" until it reaches TJ ("Max Junction Temperature"), which is the absolute limit for safe use of the regulator: Heat Sink Temperature Calculator <http://www.daycounter.com/Calculators/Heat-Sink-Temperature-Calculator.phtml> For example, With 12V source into a 3.3V LP2985 and a 30mA load, we are dissipating (12V-3.3V) * 0.03A = 0.261W. With a θJA of 206 °C/W, a TJ of 150°C, and 261mW we can safely use the chip without a heat sink up to 75°C (=147.1°C Junction Temperature).
U2 = microbuilder:MCP73831/2: MCP73831/2 LIPO Charger VDD: 3.75 - 6V Temp -40 - 85°C Programmable Charge Rate: 15-500mA NOTE: STAT is a tri-state logic output on the MCP73831 and an open-drain output on the MCP73832. SOT23-5 with 4.2V output and tri-state logic on STAT = MCP73831T-2ACI/OT
U3 = ATSAMD51G18AMUT:ATSAMD51G18A-MUT; BUILT_BY: EMA_Molly; COPYRIGHT: Copyright (C) 2018 Accelerated Designs. All rights reserved; MANUFACTURER_PART_NUMBER: ATSAMD51G18A-MUT; VENDOR: Microchip
U4 = Adafruit Feather M0 Express:MICROBUILDER_SPIFLASH_SOIC8: SOIC8 SPI Flash Be careful with the size since SOIC8 flash comes in several 'widths' SOIC8 150 mil M25P16 - 16Mbit (2Mbit x 8) Serial Flash (75MHz SPI Bus), Supply: 2.7-3.6V Digikey: SOIC8 - M25P16-VMN6P-ND SOIC8 208 mil W25Q16BVSSIG - 16Mbit (2Mbit x 8) Serial Flash (104MHz SPI Bus), Supply: 2.7-3.6V Digikey: SOIC8 - W25Q16BVSSIG-ND
U5 = MAX4468EKAT:MAX4468EKAT; DESCRIPTION: Audio Amp Microphone 1-CH Mono Class-AB 8-Pin SOT-23 T/R; DIGI-KEY_PART_NUMBER: MAX4468EKA+CT-ND; DIGI-KEY_PURCHASE_URL: https://www.digikey.com/product-detail/en/maxim-integrated/MAX4468EKA-T/MAX4468EKA-CT-ND/5405777?utm_source=snapeda&utm_medium=aggregator&utm_campaign=symbol; MF: Maxim Integrated; MP: MAX4468EKA+T; PACKAGE: SOT-23-8 Maxim
U$1 U$4 U$5 U$7 = microbuilder:MOUNTINGHOLE: Mounting Hole For #2 screws (0.086"/2.18mm width, 0.094"/2.4mm hole) use 2.5mm; BOM: EXCLUDE
U$58 = My Stuff:EINK_DISPLAY
X1 = microbuilder:CON_JST_PH_2PIN: JST 2-Pin Right-Angle Connector PH-Series - 4UConnector: 17311 SH-Series - 4UConnector: 07278
X2 = microbuilder:JTAG-CORTEX: Serial Wire (SW-DP) Connector Standard 0.05" 10-pin connector is for use with the Cortex M and Cortex A SWD (serial wire debugger) interface (SW-DP) Connectors 2x05_1.27MM_SMT - Inexpensive surface-mount header with bare pins, compatible with standard 10-pin SWD cables (4UCON: 16846) 2x05_1.27MM_BOX_NOPOSTS - Polarised surface-mount box (4UCON with caps: 19735, without caps: 15117 2x05_1.27MM_BOX_POSTS - Polarised surface-mount box with mounting holes (4UCON: 20317) Pinout: http://infocenter.arm.com/help/topic/com.arm.doc.faqs/attached/13634/cortex_debug_connectors.pdf http://www.keil.com/peripherals/coresight/connectors.asp

## Net classes
0 default: width 0.152 mm, drill 0.254 mm
1 power: width 0.305 mm, drill 0.305 mm
2 gnd: width 0.254 mm, drill 0.254 mm

## Board
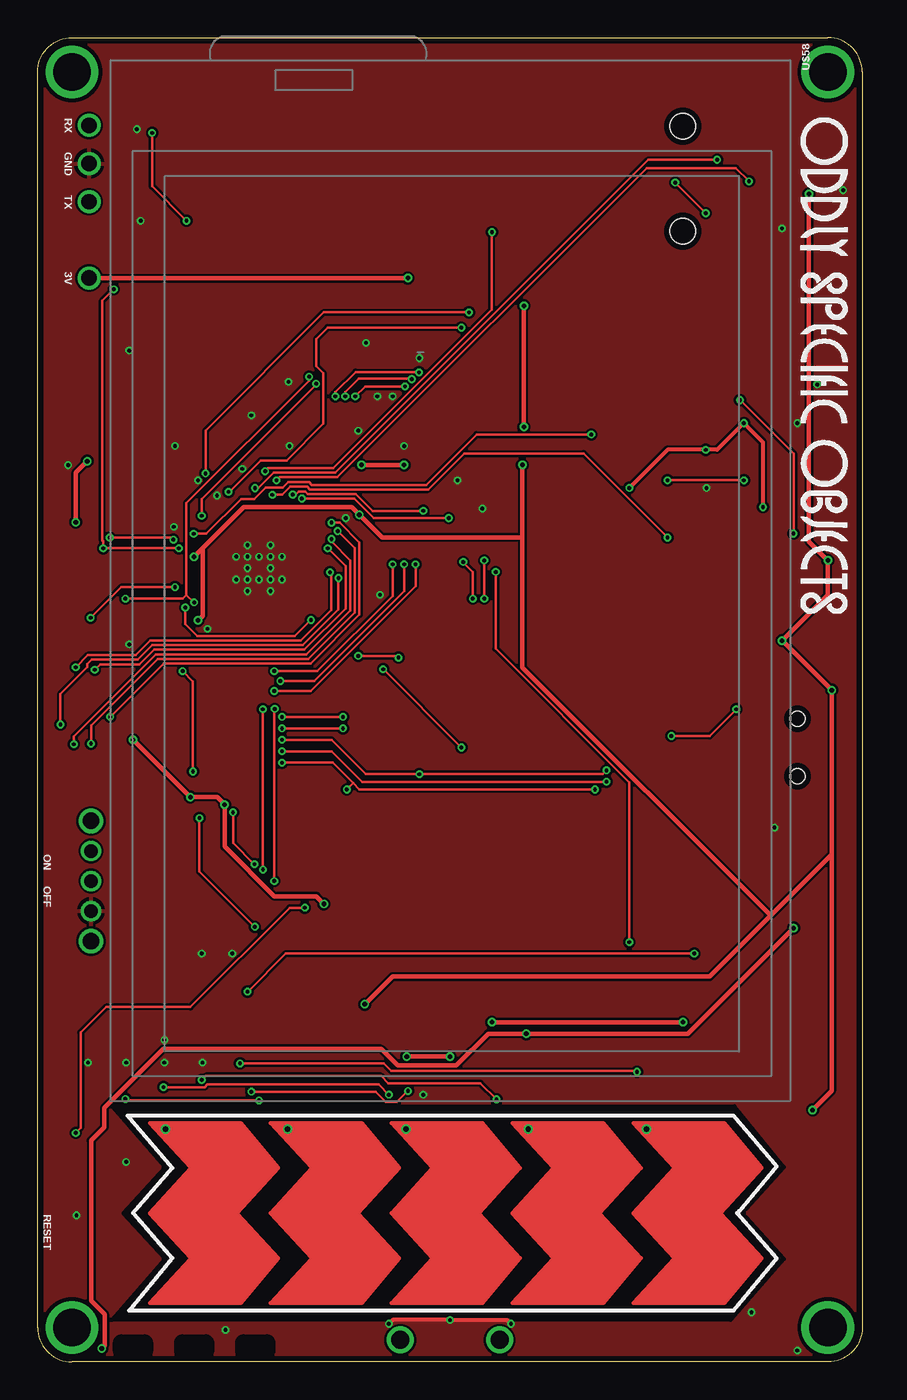
[diagram p2: board, top side]
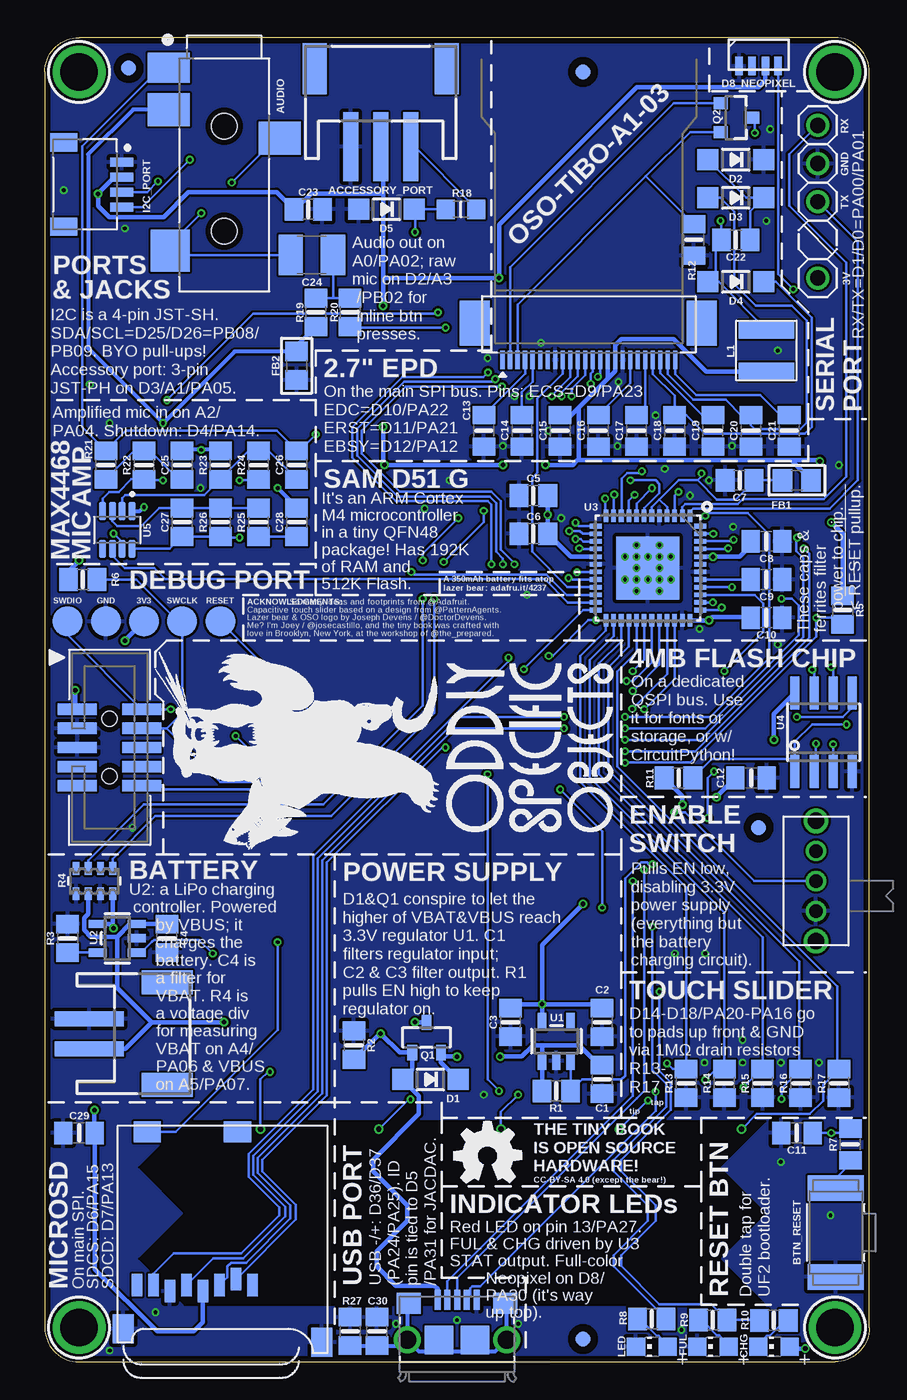
[diagram p3: board, bottom side, seen from below]

Size 54.86 x 88.14 mm. Coordinates in mm from the lower left corner, seen from the top.
Outline: 54.86,85.85 54.86,2.29 arc-90 52.58,0 2.29,0 arc-90 0,2.29 0,85.85 arc-90 2.29,88.14 52.58,88.14 arc-90 54.86,85.85
Copper layers (1*16): Top 0.035559375mm / dielectric 1.6mm / Bottom 0.035559375mm
Design rules "oshpark-2layer *": minimum track width 6mil, minimum drill 10mil, track to track 6mil, track to pad 6mil, pad to pad 6mil, via to via 6mil, smd to smd 6mil, copper to edge 15mil, drill to drill 6mil, minimum pad ring 5mil, minimum via ring 5mil, stop-mask expansion 2.5mil, vias tented up to drill 12mil, thermal gap 10mil
bKeepout: area 19.3,24.1 to 44.7,54.1
tRestrict: 1 lines

### Footprints (pad centres in the part's own frame; a part is rotated, then mirrored left to right if it is on the bottom)
JSTPH3 = smd 1 x 4.6: 1 -2,-2.7; 2 0,-2.7; 3 2,-2.7 | smd 1.6 x 3.4: NC1 -4.4,2.5; NC2 4.4,2.5
CUI_SJ-43514-SMT = smd 2 x 2.8: 1 -7.15,-3.7 | smd 2.8 x 2.6: 2 5.05,-3.6 | smd 2.2 x 2.8: 3 -2.45,3.7; 4 -4.35,-3.7 | hole 1.7: -3.25,0; 3.75,0
BTN_CK_KSS = smd 1.7 x 3.7: P$1 -2.95,0; P$2 2.95,0
0805-NO = smd 1.24 x 1.5: 1 -0.95,0; 2 0.95,0
0805_10MGAP = smd 1.2 x 1.5: 1 -1.05,0; 2 1.05,0
C1210 = smd 1.6 x 2.7: 1 -1.4,0; 2 1.4,0
CHIP-LED0805_REVERSEMOUNT = smd 1.2 x 1.2: A 0,-1.05; C 0,1.05
SOD-123 = smd 1.4 x 1.4: A 1.85,0; C -1.85,0
WS2812B_4020 = smd 0.5 x 1.25: 1 1.3,-0.75; 2 0.45,-0.75; 3 -0.45,-0.75; 4 -1.3,-0.75
0805 = smd 1.3 x 1.5: 1 -0.95,0; 2 0.95,0
FIDUCIAL_1MM = smd 1 x 1: 1 0,0
JST_SM04B-SRSS-TB(LF)(SN) = smd 0.6 x 1.55: 1 -1.5,0; 2 -0.5,0; 3 0.5,0; 4 1.5,0 | smd 1.2 x 1.8: S1 -2.8,-3.875; S2 2.8,-3.875
FCI_10118193-0001LF = smd 0.4 x 1.35: 1 -1.3,2.675; 2 -0.65,2.675; 3 0,2.675; 4 0.65,2.675; 5 1.3,2.675 | smd 1.6 x 1.4: S1 -3.2,2.45; S2 3.2,2.45 | smd 1.9 x 1.9: S3 1.2,0; S4 -1.2,0 | drill 1.2: S5 3.302,0; S6 -3.302,0
1X03 = drill 1.016: 1 -2.54,0; 2 0,0; 3 2.54,0
1X01 = drill 1.016: 1 0,0
INDUCTOR_4X4MM_NR401 = smd 1.2 x 3.7: P$1 -1.4,0; P$2 1.4,0
MICROSD = smd 0.7 x 1.5: 1 9,-10.64; 2 7.9,-10.24; 3 6.8,-10.64; 4 5.7,-11.04; 5 4.6,-10.64; 6 3.5,-11.04; 7 2.4,-10.64; 8 1.3,-10.64 | smd 1.8 x 1.4: CD1 2,-0.44; CD2 8,-0.44 | smd 1.4 x 1.9: MT1 0.4,-13.54; MT2 13.6,-14.44
SOT23-R = smd 0.635 x 1.016: 1 -0.95,-1; 2 0.95,-1; 3 0,1
SOT23-3 = smd 0.8 x 0.9: 1 -0.95,-1; 2 0.95,-1; 3 0,1.1
EXBV8V = smd 0.838 x 0.457: 1 -0.838,1.219; 2 -0.838,0.406; 3 -0.838,-0.406; 4 -0.838,-1.219; 5 0.838,-1.219; 6 0.838,-0.406; 7 0.838,0.406; 8 0.838,1.219
_0805MP = smd 1.2 x 1.3: 1 -1.016,0; 2 1.016,0
SLIDER_PASSIVE_5SEG_12MM = drill 0.356: SL1 -5.588,-13.462; SL2 -5.588,-5.334; SL3 -5.588,2.54; SL4 -5.588,10.668; SL5 -5.588,18.542
A10767 = drill 1.1: MP1 -4,0; MP2 4,0 | drill 0.9: P$1 -2,0; P$2 0,0; P$3 2,0
TESTPOINT_ROUND_2MM_NO = smd 2 x 2: P$1 0,0
SOT23-5 = smd 0.55 x 1.2: 1 -0.95,-1.3; 2 0,-1.3; 3 0.95,-1.3; 4 0.95,1.3; 5 -0.95,1.3
QFN48_7X7MC = smd 0.813 x 0.305: 1 -3.48,2.794; 2 -3.48,2.286; 3 -3.48,1.778; 4 -3.48,1.27; 5 -3.48,0.762; 6 -3.48,0.254; 7 -3.48,-0.254; 8 -3.48,-0.762; 9 -3.48,-1.27; 10 -3.48,-1.778; 11 -3.48,-2.286; 12 -3.48,-2.794; 25 3.48,-2.794; 26 3.48,-2.286; 27 3.48,-1.778; 28 3.48,-1.27; 29 3.48,-0.762; 30 3.48,-0.254; 31 3.48,0.254; 32 3.48,0.762; 33 3.48,1.27; 34 3.48,1.778; 35 3.48,2.286; 36 3.48,2.794 | smd 0.305 x 0.813: 13 -2.794,-3.48; 14 -2.286,-3.48; 15 -1.778,-3.48; 16 -1.27,-3.48; 17 -0.762,-3.48; 18 -0.254,-3.48; 19 0.254,-3.48; 20 0.762,-3.48; 21 1.27,-3.48; 22 1.778,-3.48; 23 2.286,-3.48; 24 2.794,-3.48; 37 2.794,3.48; 38 2.286,3.48; 39 1.778,3.48; 40 1.27,3.48; 41 0.762,3.48; 42 0.254,3.48; 43 -0.254,3.48; 44 -0.762,3.48; 45 -1.27,3.48; 46 -1.778,3.48; 47 -2.286,3.48; 48 -2.794,3.48 | smd 4.191 x 4.191: 49 0,0
MICROBUILDER_SOIC8_150MIL = smd 0.6 x 2.2: 1 -1.905,-2.6; 2 -0.635,-2.6; 3 0.635,-2.6; 4 1.905,-2.6; 5 1.905,2.6; 6 0.635,2.6; 7 -0.635,2.6; 8 -1.905,2.6
SOT65P280X145-8N = smd 1.21 x 0.48: 1 -1.255,0.975; 2 -1.255,0.325; 3 -1.255,-0.325; 4 -1.255,-0.975; 5 1.255,-0.975; 6 1.255,-0.325; 7 1.255,0.325; 8 1.255,0.975
MOUNTINGHOLE_2.5_PLATED = drill 2.5 pad 3.2: P$1 0,0
EINK_DISPLAY_2_7_IN = smd 1.25 x 0.275 bottom: 1 19.88,-25.679; 2 19.88,-26.179; 3 19.88,-26.679; 4 19.88,-27.179; 5 19.88,-27.679; 6 19.88,-28.179; 7 19.88,-28.679; 8 19.88,-29.179; 9 19.88,-29.679; 10 19.88,-30.179; 11 19.88,-30.679; 12 19.88,-31.179; 13 19.88,-31.679; 14 19.88,-32.179; 15 19.88,-32.679; 16 19.88,-33.179; 17 19.88,-33.679; 18 19.88,-34.179; 19 19.88,-34.679; 20 19.88,-35.179; 21 19.88,-35.679; 22 19.88,-36.179; 23 19.88,-36.679; 24 19.88,-37.179 | smd 3 x 2 bottom: SPRT1 17.42,-23.829; SPRT2 17.42,-38.939
JSTPH2 = smd 1 x 4.6: 1 -1,-3.7; 2 1,-3.7 | smd 1.6 x 3.4: NC1 -3.4,1.5; NC2 3.4,1.5
2X05_1.27MM_BOX_POSTS = smd 0.76 x 2.6: 1 -2.54,-2.15; 2 -2.54,2.15; 3 -1.27,-2.15; 4 -1.27,2.15; 5 0,-2.15; 6 0,2.15; 7 1.27,-2.15; 8 1.27,2.15; 9 2.54,-2.15; 10 2.54,2.15 | hole 1: -1.905,0; 1.905,0

### Placement (x,y rotation side)
ACCESSORY_PORT  32.51,83.57 0 bottom
AUDIO  42.93,78.99 270 bottom
BTN_RESET  2.24,8.61 90 bottom
C1  17.78,18.8 270 bottom
C2  17.78,22.61 270 bottom
C3  23.88,22.61 270 bottom
C4  46.74,28.19 270 bottom
C5  22.35,57.66 0 bottom
C6  22.35,55.12 0 bottom
C7  8.64,58.67 0 bottom
C8  6.86,54.61 180 bottom
C9  6.86,52.07 180 bottom
C10  6.86,49.53 180 bottom
C11  4.83,15.24 0 bottom
C12  7.87,38.86 0 bottom
C13  25.65,61.98 90 bottom
C14  23.11,61.98 90 bottom
C15  20.57,61.98 90 bottom
C16  18.03,61.98 90 bottom
C17  15.49,61.98 90 bottom
C18  12.95,61.98 270 bottom
C19  10.41,61.98 90 bottom
C20  7.87,61.98 270 bottom
C21  5.33,61.98 90 bottom
C22  8.89,74.68 0 bottom
C23  37.34,76.71 0 bottom
C24  37.08,73.66 180 bottom
C25  45.72,59.69 90 bottom
C26  38.1,59.69 270 bottom
C27  45.72,55.88 90 bottom
C28  38.1,55.88 90 bottom
C29  52.58,15.24 180 bottom
C30  32.77,2.03 90 bottom
CHG  6.35,1.02 90 bottom
D1  29.21,18.8 180 bottom
D2  8.89,80.01 180 bottom
D3  8.89,77.47 180 bottom
D4  8.89,71.88 180 bottom
D5  32.13,76.71 180 bottom
D8_NEOPIXEL  7.37,86.99 0 bottom
FB1  4.83,58.67 180 bottom
FB2  38.1,66.29 90 bottom
FID1  49.28,86.11 90 bottom
FID2  19.05,85.85 270 bottom
FID3  19.05,1.52 90 bottom
FID4  7.37,35.56 270 bottom
FUL  10.41,1.02 90 bottom
GOLD_ORB_SM1  25.4,13.72 0 bottom
I2C_PORT  49.73,78.36 270 bottom
J2  27.43,1.46 0 bottom
JP1  3.43,79.76 90 bottom
JP2  3.43,72.14 90 bottom
L1  6.86,67.31 270 bottom
LED  14.48,1.02 90 bottom
MICROSD  50.04,15.75 0 bottom
Q1  29.46,21.59 0 bottom
Q2  8.89,82.8 270 bottom
R1  20.83,18.03 180 bottom
R2  34.29,21.08 90 bottom
R3  53.34,28.19 90 bottom
R4  51.56,32 270 bottom
R5  1.78,50.04 90 bottom
R6  52.32,52.07 180 bottom
R7  1.27,14.48 90 bottom
R8  14.48,2.87 180 bottom
R9  10.41,2.79 0 bottom
R10  6.35,2.77 180 bottom
R11  12.7,38.86 180 bottom
R12  11.68,74.68 270 bottom
R13  12.19,18.54 90 bottom
R14  9.65,18.54 90 bottom
R15  7.11,18.54 90 bottom
R16  4.57,18.54 90 bottom
R17  2.03,18.54 90 bottom
R18  27.18,76.71 180 bottom
R19  36.83,69.85 90 bottom
R20  34.54,69.85 90 bottom
R21  50.8,59.69 270 bottom
R22  48.26,59.69 270 bottom
R23  43.18,59.69 270 bottom
R24  40.64,59.69 270 bottom
R25  40.64,55.88 270 bottom
R26  43.18,55.88 270 bottom
R27  34.54,2.03 90 bottom
SL1  21.97,9.91 270 top
SW2  3.56,32 90 bottom
TP1  53.34,49.28 0 bottom
TP2  50.8,49.28 0 bottom
TP3  48.26,49.28 0 bottom
TP4  45.72,49.28 0 bottom
TP5  43.18,49.28 0 bottom
U1  20.83,21.34 0 bottom
U2  50.04,28.19 90 bottom
U3  14.73,52.83 270 bottom
U4  3.05,41.91 0 bottom
U5  50.04,55.37 270 bottom
U$1  2.29,85.85 90 bottom
U$4  2.29,2.29 90 bottom
U$5  52.58,85.85 90 bottom
U$7  52.58,2.29 90 bottom
U$37  [OSO_WORDMARK_THREELINE_450MIL_1000DPI]  22.61,40.89 90 bottom
U$41  [OSO_BEAR_525X750MIL_1000DPI]  38.1,40.64 90 bottom
U$42  [OSO_WORDMARK_125X1300MIL_1000DPI]  52.32,82.8 270 top
U$58  50.09,86.56 270 top
X1  48.21,21.84 270 bottom
X2  50.55,40.89 270 bottom

### Tracks (layer width: path | path; a pad name or v marks a point on that pad's centre or on a via)
!RESET  (via drill 0.25)
  Top 0.152: v37.08,38.1 21.41,38.1 20.99,38.52 | 20.99,38.52 v20.57,38.1 | v17.78,30.23 16.76,30.23 10.16,23.62 4.57,23.62 2.87,21.92 2.87,15.57 v2.54,15.24 | v16.26,39.88 19.64,39.88 20.99,38.52 | v9.14,51.56 5.56,51.56 v3.53,49.53
  Bottom 0.152: TP5.P$1 37.08,43.18 v37.08,38.1 46.87,38.1 47.13,38.35 X2.10 | v20.57,38.1 17.78,35.31 v17.78,30.23 | C11.2 v2.54,15.24 1.56,15.24 R7.2 | v16.26,39.88 11.91,39.88 3.53,48.26 v3.53,49.53 2.22,49.53 R5.1 | v9.14,51.56 U3.40
+3V3  (via drill 0.3)
  Top 0.305: v21.77,23.8 23.62,25.65 44.7,25.65 48.77,29.72 | 48.77,29.72 52.83,33.78 | 52.83,33.78 v52.83,44.7 v49.53,48.01 52.58,51.05 v52.58,53.34 51.31,54.61 v51.31,77.72 | v32.26,59.69 32.26,54.86 | 32.26,54.86 32.26,46.23 48.77,29.72 | v19.05,30.48 18.54,30.99 15.75,30.99 12.45,34.29 v12.45,37.08 11.94,37.59 v10.16,37.59 v6.35,41.4 | 52.83,33.78 52.83,18.03 v51.56,16.76 | v24.38,59.69 v21.54,59.69 | 32.26,54.86 22.93,54.86 v21.4,56.39 20.89,56.9 13.72,56.9 10.97,54.15 | 10.97,54.15 v10.41,53.59 | 10.97,54.15 10.97,49.66 v10.67,49.35 | v32.35,62.23 v32.35,70.28 | v2.54,55.88 2.54,59.18 v3.3,59.94 | JP2.1 v24.64,72.14
  Bottom 0.305: C15.2 19.91,62.93 19.32,63.52 | U$58.15 17.41,65.43 | L1.P$2 10.85,65.91 13.01,68.07 16.51,68.07 16.91,67.67 U$58.16 16.91,65.93 17.41,65.43 | 17.41,65.43 19.32,63.52 | C3.1 23.62,23.81 21.84,23.81 | 21.84,23.81 18.03,23.81 C2.1 | U1.5 21.78,23.74 | 21.84,23.81 21.78,23.74 | 19.32,63.52 19.32,60.01 | 21.78,23.74 v21.78,23.79 v21.77,23.8 21.77,27.76 v19.05,30.48 | v52.83,44.7 52.83,43.57 X2.1 | v49.53,48.01 TP3.P$1 | v52.58,53.34 53.27,52.64 R6.2 | ACCESSORY_PORT.2 32.35,80.71 32.35,77.76 | 32.35,77.76 37.13,77.76 38.19,76.71 C23.1 39.44,77.86 45.3,77.86 46.96,76.2 50.58,76.2 51.31,76.93 v51.31,77.72 51.31,77.79 50.24,78.86 I2C_PORT.2 | 32.35,77.76 32.35,72.14 | 32.35,72.14 v32.35,70.28 | v32.35,62.23 32.35,59.78 v32.26,59.69 v24.38,59.69 | U4.8 6.35,43.11 v6.35,41.4 | v10.16,37.59 10.16,37.63 C12.1 | 32.35,72.14 v24.64,72.14 24.64,75.69 15.49,84.84 7.37,84.84 6.92,85.29 D8_NEOPIXEL.2 | MICROSD.4 44.34,2.65 44.96,2.03 47.38,2.03 51.53,6.18 C29.1 51.56,15.27 v51.56,16.76 | FB1.1 5.21,60.01 | 19.32,60.01 5.21,60.01 | C10.2 7.86,49.58 10.44,49.58 v10.67,49.35 U3.36 | U3.44 v10.41,53.59 8.64,53.59 7.91,54.32 C8.2 | v12.45,37.08 12.45,37.66 R11.2 | U3.17 19.88,53.59 C6.2 v21.4,56.39 C5.2 | 19.32,60.01 19.43,60.01 19.75,59.69 v21.54,59.69 | R5.2 1.78,55.12 v2.54,55.88 | 5.21,60.01 3.37,60.01 v3.3,59.94
_ACCESSORY
  Bottom 0.152: ACCESSORY_PORT.3 30.26,80.87 26.42,77.02 26.42,76.96 R18.1
A0_AUDIO  (via drill 0.25)
  Top 0.152: v28.19,68.83 19.3,68.83 18.54,68.07 18.54,66.28 19.02,65.81 19.02,62.45 16.56,60 14.86,60 12.78,57.91 v12.7,57.91
  Bottom 0.152: U3.3 12.95,57.66 v12.7,57.91 | v28.19,68.83 28.2,68.82 34.47,68.82 R20.1
A2_MICAMP  (via drill 0.25)
  Top 0.152: v15.62,57.71 16.28,57.71 16.81,58.24 17.93,58.24 18.11,58.06 25.98,58.06 28.37,60.45 36.32,60.45 v41.91,54.86
  Bottom 0.152: U3.9 16,57.33 v15.62,57.71 | v41.91,54.86 43.11,54.86 R26.2 C27.1 46.53,54.12 U5.8
A4_VBATMON  (via drill 0.25)
  Top 0.152: v16.98,57.72 17.17,57.72 17.38,57.94 17.8,57.94 17.98,57.76 21.18,57.76 22.3,56.64 v25.65,56.64 | v28.32,53.24 28.32,53.21 28.96,52.58 v28.96,50.8
  Bottom 0.152: R4.2 R4.1 50.34,33.48 47.5,36.32 35.81,36.32 28.96,43.18 v28.96,50.8 | v16.98,57.72 16.95,57.7 17.02,57.63 U3.11 | v28.32,53.24 25.65,55.91 v25.65,56.64
A5_VBUSMON  (via drill 0.25)
  Top 0.152: v29.72,50.8 v29.72,53.34 | v27.36,56.16 22.35,56.16 21.05,57.46 v17.58,57.46
  Bottom 0.152: R4.4 R4.3 51.97,33.38 48.26,37.08 36.32,37.08 29.72,43.69 v29.72,50.8 | U3.12 17.58,56.37 v17.58,57.46 | v29.72,53.34 29.72,53.8 v27.36,56.16
AGND  (via drill 0.25)
  Top 0.254: v48.26,56.9 48.26,61.21 v46.99,62.48 45.21,60.71 v44.45,60.71 41.91,60.71 v39.37,58.17
  Bottom 0.254: R19.1 38.1,67.63 FB2.2 42.23,67.24 v46.99,62.48 51.97,67.46 51.97,80.36 48.99,83.34 AUDIO.4 | C25.2 45.65,60.71 v44.45,60.71 43.25,60.71 R23.1 | U5.1 48.53,56.63 v48.26,56.9 | v39.37,58.17 39.37,58.15 38.1,56.88 C28.2
AUDIO_OUT  (via drill 0.25)
  Top 0.152: v42.42,78.49 v44.45,76.45
  Bottom 0.152: C24.2 46.24,73.66 AUDIO.2 46.53,74.38 v44.45,76.45 | AUDIO.3 39.46,81.44 v42.42,78.49
AVCC  (via drill 0.25)
  Top 0.152: v11.18,59.13 11.18,61.98 19.05,69.85 v28.7,69.85 | v46.74,64.01 50.29,60.45 v50.29,55.13
  Bottom 0.152: U3.6 14.48,56.9 13.97,57.4 | FB1.2 C7.2 7.69,58.61 8.89,57.4 10.16,57.4 11.43,58.67 | 13.97,57.4 12.7,58.67 11.43,58.67 | U3.4 13.46,56.9 13.97,57.4 | 11.43,58.67 11.18,58.93 v11.18,59.13 | v46.74,64.01 40.99,69.75 28.8,69.75 v28.7,69.85 | v50.29,55.13 50.11,54.95 50.1,54.95 49.71,54.57 U5.7
D0_SERCOM1_RX
  Bottom 0.152: U3.2 12.45,56.9 12.24,57.1 8.76,57.1 8.43,57.43 3.02,57.43 1.52,58.93 1.52,73.15 5.33,76.96 5.33,80.39 JP1.3
D1_SERCOM1_TX
  Bottom 0.152: JP1.1 0.76,74.55 0.76,58.67 2.64,56.79 11.71,56.79 11.94,56.57 U3.1
D2_A3_ACCESSORY  (via drill 0.25)
  Top 0.152: v30.23,75.18 30.23,70.03 19.69,59.49 15.35,59.49 v15.14,59.28
  Bottom 0.152: v30.23,75.18 30.23,76.65 D5.C R18.2 | U3.10 16.48,56.34 16.48,58.77 16.1,59.16 15.27,59.16 v15.14,59.28
D3_A1_MICRAW  (via drill 0.25)
  Top 0.152: v36.83,61.72 29.21,61.72 25.86,58.37 18.24,58.37 18.06,58.55 18.04,58.55 18.03,58.55 16.66,58.55 16.3,58.19 15.18,58.19 14.42,57.43 13.54,57.43 11.23,55.12 10.41,55.12 v10.39,55.12
  Bottom 0.152: v36.83,61.72 37.91,60.64 C26.1 39.44,61.98 49.46,61.98 R21.1 52.38,62.22 52.38,80.9 47.13,86.14 AUDIO.1 | U3.47 v10.39,55.12
D4_MICSHDN
  Bottom 0.152: U3.23 20.07,50.55 21.61,52.09 46.84,52.09 47.58,52.83 49.53,52.83 50.36,53.66 U5.6
D5_SWDIO_USBID  (via drill 0.25)
  Top 0.152: v46.48,43.43 44.7,41.66 v42.16,41.66 | v37.85,39.37 37.59,39.12 v25.4,39.12 21.84,39.12 19.56,41.4 v16.26,41.4 | v4.8,54.86 8.89,54.86 v9.03,54.72 | v14.22,17.98 22.48,17.98 23.17,17.3 23.9,17.3 v24.64,18.03
  Bottom 0.152: TP1.P$1 53.34,48.38 X2.2 v46.48,43.43 | v42.16,41.66 39.88,39.37 v37.85,39.37 | v16.26,41.4 11.25,41.4 4.39,48.26 4.39,53.5 4.85,53.95 4.85,54.61 4.8,54.66 v4.8,54.86 | v9.03,54.72 9.14,54.61 9.17,54.61 9.2,54.64 11.12,54.64 11.15,54.61 U3.46 | J2.4 26.56,4.36 26.56,4.9 26.43,5.04 25.88,5.04 14.22,16.69 v14.22,17.98 | v24.64,18.03 25.4,18.8 v25.4,39.12
D6_SDCS  (via drill 0.25)
  Top 0.152: v22.99,46.1 v28.2,40.9
  Bottom 0.152: MICROSD.2 38.15,9.5 38.15,10.46 40.39,12.7 40.39,13.46 36.09,17.75 36.09,33.23 28.42,40.9 v28.2,40.9 | U3.24 19.05,50.04 v22.99,46.1
D7_SDCD  (via drill 0.25)
  Top 0.152: v30.48,52.58 30.48,47.47 39.37,38.58 v39.37,27.94
  Bottom 0.152: U3.22 20.14,51.05 21.49,52.4 30.3,52.4 v30.48,52.58 | v39.37,27.94 39.37,22.1 46.16,15.31 MICROSD.CD1
D8_SWCLK_NEOPIX  (via drill 0.25)
  Top 0.152: v37.85,38.61 21.59,38.61 19.56,40.64 v16.26,40.64 | v9.4,54.15 v4.37,54.15 4.37,54.61 4.32,54.66 4.32,70.64 v5.07,71.39
  Bottom 0.152: TP4.P$1 45.72,49.02 | 45.72,49.02 45.72,43.18 46.74,42.16 | 46.74,42.16 X2.4 | R6.1 48.77,52.07 45.72,49.02 | 46.74,42.16 43.18,38.61 v37.85,38.61 | v16.26,40.64 11.58,40.64 4.01,48.21 4.01,53.8 v4.37,54.15 | U3.45 9.45,54.1 v9.4,54.15 | v5.07,71.39 6.07,72.39 D8_NEOPIXEL.1
D9_EINK_CS  (via drill 0.25)
  Top 0.152: v15.75,44.65 18.16,44.65 25.15,51.64 v25.15,53.09 | v19.81,64.26 19.81,64.54 21.16,65.89 25.09,65.89 25.14,65.84 25.35,65.84 v25.37,65.86
  Bottom 0.152: U$58.12 18.91,65.67 19.81,64.77 v19.81,64.26 | v15.75,44.65 15.57,44.83 15.55,44.83 13.97,46.41 U3.32 | v25.37,65.86 25.7,65.53 31.09,65.53 34.39,62.23 34.39,60.2 31.5,57.3 25.4,57.3 25.15,57.05 v25.15,53.09
D10_EINK_DC  (via drill 0.25)
  Top 0.152: v16.15,45.31 18.39,45.31 24.38,51.31 v24.38,53.09 | v20.47,64.26 20.47,64.54 21.36,65.43 24.87,65.43 v24.89,65.41
  Bottom 0.152: U$58.11 19.41,65.6 20.47,64.54 v20.47,64.26 | v16.15,45.31 15.73,45.31 14.48,46.56 U3.31 | v24.89,65.41 25.07,65.23 30.96,65.23 34.09,62.1 34.09,60.33 31.37,57.61 25.27,57.61 24.84,57.17 24.84,53.92 24.38,53.47 v24.38,53.09
D11_EINK_RST  (via drill 0.25)
  Top 0.152: v15.75,45.97 18.62,45.97 23.62,50.98 v23.62,53.09 | v21.13,64.26 21.79,64.92 v24.44,64.92
  Bottom 0.152: U$58.10 19.91,65.53 21.13,64.31 v21.13,64.26 | U3.30 14.99,46.74 v15.75,45.97 | v24.44,64.92 30.84,64.92 33.78,61.98 33.78,60.45 31.24,57.91 25.15,57.91 24.53,57.3 24.53,54.07 23.62,53.16 v23.62,53.09
D12_EINK_BUSY
  Bottom 0.152: U3.21 20.09,51.56 22.45,53.92 22.45,58.83 22.1,59.18 22.1,64.1 20.41,65.79 U$58.9
D13_LED  (via drill 0.25)
  Top 0.152: v10.77,36.2 10.77,32.64 v14.45,28.96 | v9.65,45.97 10.34,45.29 v10.34,39.29
  Bottom 0.152: U3.39 7.64,51.05 7.05,50.47 7.05,48.57 v9.65,45.97 | R8.1 17.02,6.36 17.02,7.11 14.73,9.4 14.73,10.41 17.02,12.7 17.02,13.46 13.51,16.97 13.51,18.49 14.45,19.43 v14.45,28.96 | v10.77,36.2 10.77,38.86 v10.34,39.29
D14_HSLIDER_1
  Bottom 0.152: U3.29 15.49,47.24 16.77,45.96 16.77,39.64 2.13,24.99 2.13,19.4 | SL1.SL1 7.49,16.51 3.96,16.51 3.08,17.38 3.08,18.44 2.13,19.4 | 2.13,19.4 R17.2
D15_HSLIDER_2  (via drill 0.25)
  Top 0.152: v5.84,17.5 5.94,17.4 v14.73,17.4
  Bottom 0.152: U3.28 16,47.6 17.39,46.22 17.39,39.39 4.67,26.66 4.67,19.4 | SL1.SL2 v14.73,17.4 | R16.2 4.67,19.4 | 4.67,19.4 5.84,18.22 v5.84,17.5
D16_HSLIDER_3  (via drill 0.25)
  Top 0.152: v8.38,18.29 11.12,18.29 11.3,18.47 22.68,18.47 v23.37,17.78
  Bottom 0.152: SL1.SL3 24.51,16.64 v23.37,17.78 | v8.38,18.29 7.18,19.49 R15.2 7.11,28.25 18,39.13 18,46.47 16.51,47.96 U3.27
D17_HSLIDER_4  (via drill 0.25)
  Top 0.152: v10.92,18.77 11.18,19.02 22.86,19.02 23.34,18.54 29.46,18.54 v30.53,17.48
  Bottom 0.152: SL1.SL4 30.66,17.48 v30.53,17.48 | v10.92,18.77 10.2,19.49 R14.2 9.65,29.92 18.62,38.89 18.62,46.71 17.02,48.31 U3.26
D18_HSLIDER_5  (via drill 0.25)
  Top 0.152: v39.88,19.3 39.83,19.36 23.54,19.36 23.03,19.86 v13.46,19.86
  Bottom 0.152: v39.88,19.3 40.01,19.3 40.51,18.8 SL1.SL5 | v13.46,19.86 13.09,19.49 R13.2 12.19,31.57 19.23,38.61 19.23,46.97 17.53,48.67 U3.25
D25_SERCOM4_SDA  (via drill 0.25)
  Top 0.152: v15.9,58.67 16.1,58.88 19.94,58.88 40.51,79.45 46.45,79.45 v47.33,78.57
  Bottom 0.152: U3.7 14.99,56.82 13.97,57.84 13.97,58.42 14.22,58.67 v15.9,58.67 | I2C_PORT.3 48.05,77.86 v47.33,78.57
D26_SERCOM4_SCL  (via drill 0.25)
  Top 0.152: v45.21,80.01 40.64,80.01 19.81,59.18 15.72,59.18 14.7,58.16 v14.46,58.16
  Bottom 0.152: v14.46,58.16 15.49,57.12 U3.8 | I2C_PORT.4 48.36,76.86 v45.21,80.01
D27_SERCOM5_MISO  (via drill 0.25)
  Top 0.152: v9.82,50.21 9.82,49.11 10.62,48.31 17.12,48.31 v18.19,49.38 | v21.34,46.99 23.9,46.99 v24.01,46.87
  Bottom 0.152: MICROSD.7 47.64,5.87 46.29,7.21 41.78,7.21 39.26,9.74 39.26,10.28 41.3,12.32 41.3,13.84 37.01,18.13 37.01,33.63 24.01,46.62 v24.01,46.87 | U3.37 9.99,50.04 v9.82,50.21 | v18.19,49.38 18.7,49.38 21.08,46.99 v21.34,46.99
D28_SERCOM5_MOSI  (via drill 0.25)
  Top 0.152: 9.91,51.05 9.91,57.16 18.07,65.32 v18.07,65.57 | v10.41,50.55 9.91,51.05 | v20.32,42.16 v16.26,42.16 | v5.84,50.8 9.65,50.8 9.91,51.05
  Bottom 0.152: MICROSD.3 42.72,5.63 42.72,6.35 42.47,6.6 41.47,6.6 38.53,9.54 38.53,10.42 40.69,12.57 40.69,13.59 36.4,17.88 36.4,33.38 27.61,42.16 v20.32,42.16 | U3.38 v10.41,50.55 | v18.07,65.57 17.91,65.72 U$58.14 | v16.26,42.16 10.92,42.16 4.7,48.39 4.7,50.35 5.15,50.8 v5.84,50.8
D29_SERCOM5_SCK  (via drill 0.25)
  Top 0.152: v10.92,56.31 10.92,57.43 18.54,65.04 v18.54,65.1 | v20.32,42.93 v16.26,42.93
  Bottom 0.152: MICROSD.5 43.64,6.91 41.66,6.91 38.86,9.7 38.86,10.31 41,12.45 41,13.71 36.7,18.01 36.7,33.5 27.28,42.93 v20.32,42.93 | U$58.13 18.41,65.91 18.55,65.77 18.55,65.37 18.54,65.35 v18.54,65.1 | U3.48 11.25,55.98 11.01,56.22 v10.92,56.31 10.76,56.48 8.1,56.48 6.67,55.05 6.67,46.84 10.59,42.93 v16.26,42.93
D30_QSPI_SCK  (via drill 0.25)
  Top 0.152: v19.46,52.55 19.53,52.48 19.53,50.04 17.5,48.01 7.5,48.01 6.53,47.04 3.35,47.04 v2.54,46.23
  Bottom 0.152: v19.46,52.55 19.43,52.58 U3.19 | v2.54,46.23 2.41,46.1 U4.6
D31_QSPI_CS  (via drill 0.25)
  Top 0.152: v20.02,52.17 20.02,50.09 17.63,47.7 7.62,47.7 6.66,46.74 3.62,46.74 3.32,46.44 3.32,46.24 1.52,44.45 v1.52,42.42
  Bottom 0.152: U3.20 19.91,52.07 v20.02,52.17 | v1.52,42.42 3.81,42.42 4.95,41.28 4.95,40.13 | 4.95,40.13 U4.1 | R11.1 10.48,40.13 4.95,40.13
D32_QSPI_DATA[0]  (via drill 0.25)
  Top 0.152: v19.56,55.86 20.09,55.86 21.41,54.53 21.41,49.74 18.16,46.48 8.38,46.48 v4.83,42.93
  Bottom 0.152: U3.13 19.33,55.63 v19.56,55.86 | v4.83,42.93 1.78,42.93 1.14,43.56 U4.5
D33_QSPI_DATA[1]  (via drill 0.25)
  Top 0.152: v19.96,55.3 21.11,54.15 21.11,49.87 18.02,46.79 8,46.79 3.58,42.36 3.58,41.17 v3.56,41.15
  Bottom 0.152: U3.14 19.08,55.12 19.26,55.3 v19.96,55.3 | v3.56,41.15 3.56,40.39 3.68,40.26 U4.2
D34_QSPI_DATA[2]  (via drill 0.25)
  Top 0.152: v19.56,54.76 19.56,54.58 20.8,53.34 20.8,50.01 17.89,47.09 7.87,47.09 2.41,41.63 v2.41,41.1
  Bottom 0.152: U3.15 19.04,54.61 19.2,54.76 v19.56,54.76 | v2.41,41.1 U4.3
D35_QSPI_DATA[3]  (via drill 0.25)
  Top 0.152: v19.3,54.15 20.5,52.96 20.5,50.14 17.75,47.4 7.75,47.4 6.77,46.41 4.16,46.41 v3.8,46.06
  Bottom 0.152: v19.3,54.15 19.25,54.1 U3.16 | v3.8,46.06 3.68,45.94 U4.7
EN  (via drill 0.25)
  Top 0.152: v13.01,36.58 13.01,34.54 v14.43,33.12
  Bottom 0.152: U1.3 R1.1 19.12,18.8 16.51,18.8 16.26,19.05 16.26,32.18 15.19,33.25 14.79,33.25 14.66,33.12 v14.43,33.12 | v13.01,36.58 12.24,36.58 7.67,32 SW2.P$2
GDR
  Bottom 0.152: U$58.2 23.91,72.86 13.02,83.75 Q2.1
GND  (via drill 0.25)
  Top 0.254: v31.5,2.54 31.24,2.79 v27.43,2.79 23.62,2.79 v23.37,2.54
  other vias: 10.92,27.18 47.5,3.3 49.53,75.44 53.59,77.98 21.84,67.82 25.4,66.8 16.69,65.23 14.22,62.99 9.14,60.96 6.1,67.31 11.94,57.66 15.49,54.36 13.97,54.36 16.26,53.59 15.49,53.59 14.73,53.59 13.97,53.59 13.21,53.59 15.49,52.83 13.97,52.83 16.26,52.07 15.49,52.07 14.73,52.07 13.97,52.07 13.21,52.07 15.49,51.31 13.97,51.31 10.67,58.67 13.61,59.44 22.78,51.05 11.3,48.79 16.76,60.96 21.34,61.98 22.61,64.26 23.62,64.26 24.38,60.96 29.59,56.79 27.94,58.67 25.65,17.78 6.1,47.75 12.5,2.13 50.55,0.76 10.97,19.91 8.43,19.91 8.43,21.44 5.89,19.91 3.35,19.91 2.59,9.75 12.95,27.18 20.5,56.16 2.03,59.69 50.55,62.48 51.87,65.05 9.07,55.58 49.02,35.56 6.86,75.95 6.6,82.04 44.5,58.17 5.89,13.31
  pour Bottom (rank 6): 57.15,-1.27 57.15,88.39 56.64,88.9 1.52,88.9 -1.52,85.85 -1.52,1.02 0.76,-1.27
  pour Top: 58.17,-0.76 58.17,90.68 -2.78,90.68 -2.78,3.54 1.52,-0.76
  cutout Bottom (rank 6): 45.54,16 6.93,16 9.98,12.95 6.93,9.91 9.98,6.86 6.93,3.81 45.54,3.81 48.59,6.86 45.54,9.91 48.59,12.95
MIC_BIAS_PWR  (via drill 0.25)
  Top 0.152: v46.99,58.67 v41.91,58.67
  Bottom 0.152: U5.4 51.01,57.45 50.57,57.89 49.95,57.89 49.1,58.74 R22.2 48.19,58.67 v46.99,58.67 | v41.91,58.67 40.71,58.67 R24.2
N$1
  Bottom 0.152: R7.1 1.27,13.17 2.23,12.21 BTN_RESET.P$2
N$2
  Bottom 0.152: D2.A 8.2,77.47 D3.C 7.94,76.57 C22.2
N$3  (via drill 0.25)
  Top 0.152: v9.91,75.95 7.62,78.23 v7.62,81.79
  Bottom 0.152: L1.P$1 10.03,71.88 D4.A 10.23,72.39 10.23,74.28 C22.1 9.84,75.88 v9.91,75.95 | Q2.3 7.62,82.63 v7.62,81.79
N$4
  Bottom 0.152: R10.1 5.6,2.77 6.64,1.73 6.83,1.73 7.12,1.43 7.12,1.49 7.4,1.22 CHG.C
N$6
  Bottom 0.152: 35.68,70.8 R19.2 | C24.1 35.68,70.8 | R20.2 35.68,70.8
N$7
  Bottom 0.152: R8.2 15.28,2.87 14.14,1.73 14,1.73 13.43,1.15 LED.A
N$9
  Bottom 0.152: R9.1 11.17,2.79 10.16,1.78 9.99,1.78 9.36,1.15 FUL.A
N$65
  Bottom 0.152: R21.2 48.9,60.64 R22.1 47.87,60.64 45.97,58.74 C25.1
N$67
  Bottom 0.152: U5.2 49.71,57.48 49.51,57.68 44.24,57.68 R23.2 41.28,60.64 R24.1 40,60.64 C26.2
N$68
  Bottom 0.152: R25.1 R26.1 C27.2 47.24,56.83 48.45,55.63 50.04,55.63 50.36,55.95 U5.3
N$69
  Bottom 0.152: C28.1 R25.2
PREVGH
  Bottom 0.152: D4.C 6.24,71.88 3.85,69.49 3.85,62.21 4.29,61.77 10.94,61.77 12.19,63.03 C18.1 12.95,64.3 14.41,65.75 U$58.21
PREVGL
  Bottom 0.152: C20.1 | C20.1 8.49,62.95 9.57,64.03 9.65,64.03 | 9.65,64.03 9.91,64.03 11.71,64.03 13.41,65.73 U$58.23 | D3.A 9.93,77.47 8.99,76.54 8.99,71.73 7.56,70.3 5.17,70.3 4.16,69.3 4.16,62.53 4.61,62.08 7.62,62.08 7.88,62.34 C20.1 | 9.65,64.03
PROG
  Bottom 0.152: R3.1 U2.5
RESE
  Bottom 0.152: Q2.2 11.92,81.85 14.87,78.91 | 14.87,78.91 23.41,70.37 U$58.3 | R12.1 14.87,78.91
SHIELD
  Bottom 0.254: R27.1 C30.1 31.11,1.08 J2.S6 | J2.S6 29.97,0.7 29.39,0.7 J2.S4 27.87,0.7 26.99,0.7 J2.S3 25.47,0.7 24.89,0.7 J2.S5 24.13,3.81 J2.S2 | J2.S1 30.73,3.81 J2.S6
STAT  (via drill 0.25)
  Top 0.152: v13.97,24.64 16.51,27.18 v43.69,27.18
  Bottom 0.152: R10.2 7.33,2.79 R9.2 10.52,3.85 13.97,3.85 16.51,6.39 16.51,7.11 14.22,9.4 14.22,10.41 16.51,12.7 16.51,13.46 13.21,16.76 13.21,18.62 13.97,19.38 v13.97,24.64 | v43.69,27.18 44.6,28.09 47.58,28.09 47.73,27.94 47.75,27.94 48.45,27.24 U2.1
USB_N  (via drill 0.25)
  Top 0.152: v15.75,32 15.75,43.43 v15.78,43.46
  Bottom 0.152: J2.2 28.08,5.37 15.75,17.7 v15.75,32 | v15.78,43.46 13.46,45.77 U3.33
USB_P  (via drill 0.25)
  Top 0.152: v14.99,32.77 v14.99,43.43
  Bottom 0.152: J2.3 27.43,5.59 15.49,17.53 | v14.99,32.77 14.99,18.03 15.49,17.53 | U3.34 12.95,45.47 v14.99,43.43 | 15.49,17.53
V+  (via drill 0.3)
  Top 0.305: v27.43,20.32 v24.56,20.32
  Bottom 0.305: 21.78,21.08 U1.1 R1.2 | 21.78,21.08 19.3,21.08 17.97,19.75 C1.1 | D1.C 28.51,19.95 Q1.2 28.24,20.32 v27.43,20.32 | v24.56,20.32 23.11,20.32 22.35,21.08 21.78,21.08
VBAT  (via drill 0.3)
  Top 0.305: v42.93,22.61 v30.23,22.61
  Bottom 0.305: X1.2 49.51,20.84 47.75,22.61 | 47.75,22.61 v42.93,22.61 | v30.23,22.61 30.21,22.59 Q1.3 | 50.05,28.3 51.8,28.3 52.24,28.74 52.24,29.54 51.97,29.82 R4.6 | 50.05,28.3 49.2,29.14 U2.3 C4.1 | 50.05,28.3 50.05,24.9 47.75,22.61
VBUS  (via drill 0.3)
  Top 0.305: v50.29,28.88 43.26,21.84 v32.51,21.84 29.97,21.84 27.86,19.74 23.95,19.74 22.86,20.83 8.36,20.83 4.44,16.91 4.44,15.61 3.56,14.73 3.56,4.08 4.45,3.18 4.45,1.08 v4.27,0.89
  Bottom 0.305: U2.4 50.56,29.14 v50.29,28.88 50.34,28.93 R4.8 | CHG.A 5.17,0.89 v4.27,0.89 | J2.1 28.73,4.86 28.96,5.08 31.5,5.08 32.77,6.35 32.77,7.37 30.73,9.4 30.73,10.41 33.02,12.7 33.02,13.46 29.97,16.51 29.97,17.71 D1.A 30.41,19.44 Q1.1 31.26,20.59 v32.51,21.84 32.58,21.84 R2.1
VCOM
  Bottom 0.152: U$58.24 12.91,65.74 11.51,64.34 7.26,64.34 5.95,63.03 C21.2
VDD
  Bottom 0.152: C16.2 15.91,65.15 U$58.18
VDDCORE
  Bottom 0.152: U3.41 C9.2
VGH
  Bottom 0.152: C14.2 23.11,64.55 22.41,65.25 U$58.5
VGL
  Bottom 0.152: U$58.4 22.91,65.77 C13.2
VSH
  Bottom 0.152: C17.2 14.91,63.51 U$58.20
VSL
  Bottom 0.152: U$58.22 13.91,65.8 11.13,63.03 C19.2

### Text on the board
tPlace: RX | GND | TX | 3V | ON | OFF | RESET
bPlace: RX | GND | TX | Audio out on / A0/PA02; raw / mic on D2/A3 / /PB02 for / inline btn / presses. | OSO-TIBO-A1-03 | PORTS / & JACKS | 3V | I2C is a 4-pin JST-SH. / SDA/SCL=D25/D26=PB08/ / PB09. BYO pull-ups! / Accessory port: 3-pin / JST-PH on D3/A1/PA05. | RX/TX=D1/D0=PA00/PA01 | 2.7" EPD | On the main SPI bus. Pins: ECS=D9/PA23 / EDC=D10/PA22 / ERST=D11/PA21 / EBSY=D12/PA12 | SERIAL / PORT | Amplified mic in on A2/ / PA04. Shutdown: D4/PA14. | SAM D51 G | It's an ARM Cortex / M4 microcontroller / in a tiny QFN48 / package! Has 192K / of RAM and / 512K Flash. | AMP | MAX4468 / MIC | A 350mAh battery fits atop / lazer bear: adafru.it/4237 | DEBUG PORT | ACKNOWLEDGMENTS: | So many ideas and footprints from @Adafruit. / Capacitive touch slider based on a design from @PatternAgents. / Lazer bear & OSO logo by Joseph Devens / @DoctorDevens. / Me? I'm Joey / @josecastillo, and the tiny book was crafted with / love in Brooklyn, New York, at the workshop of @the_prepared. | RESET | SWCLK | 3V3 | GND | SWDIO | These caps & / ferrites filter / power to chip. / < !RESET pullup. | 4MB FLASH CHIP | On a dedicated / QSPI bus. Use / it for fonts or / storage, or w/ / CircuitPython! | ENABLE / SWITCH | Pulls EN low, / disabling 3.3V / power supply / (everything but / the battery / charging circuit). | POWER SUPPLY | BATTERY | U2: a LiPo charging / controller. Powered / by VBUS; it / charges the / battery. C4 is / a filter for / VBAT. R4 is / a voltage div / for measuring / VBAT on A4/ / PA06 & VBUS / on A5/PA07. | D1&Q1 conspire to let the / higher of VBAT&VBUS reach / 3.3V regulator U1. C1 / filters regulator input; / C2 & C3 filter output. R1 / pulls EN high to keep / regulator on. | TOUCH SLIDER | D14-D18/PA20-PA16 go / to pads up front & GND / via 1MΩ drain resistors / R13- / R17 | tap | tip | THE TINY BOOK / IS OPEN SOURCE / HARDWARE! | CC-BY-SA 4.0 (except the bear!) | INDICATOR LEDs | Red LED on pin 13/PA27. / FUL & CHG driven by U3 / STAT output. Full-color / Neopixel on D8/ / PA30 (it's way / up top). | Double tap for / UF2 bootloader. | RESET BTN | USB -/+: D36/D37 / (PA24/PA25). ID / pin is tied to D5 / /PA31 for JACDAC. | USB PORT | On main SPI. / SDCS: D6/PA15 / SDCD: D7/PA13 | MICROSD
tStop: THE | tiny | BOOK